# EAGLE design RetroESP32.serial (EAGLE 9.6.2)

## Sheet 1 of 9: POWER (SOURCE, BATTERY, CHARGE, CONTROL)
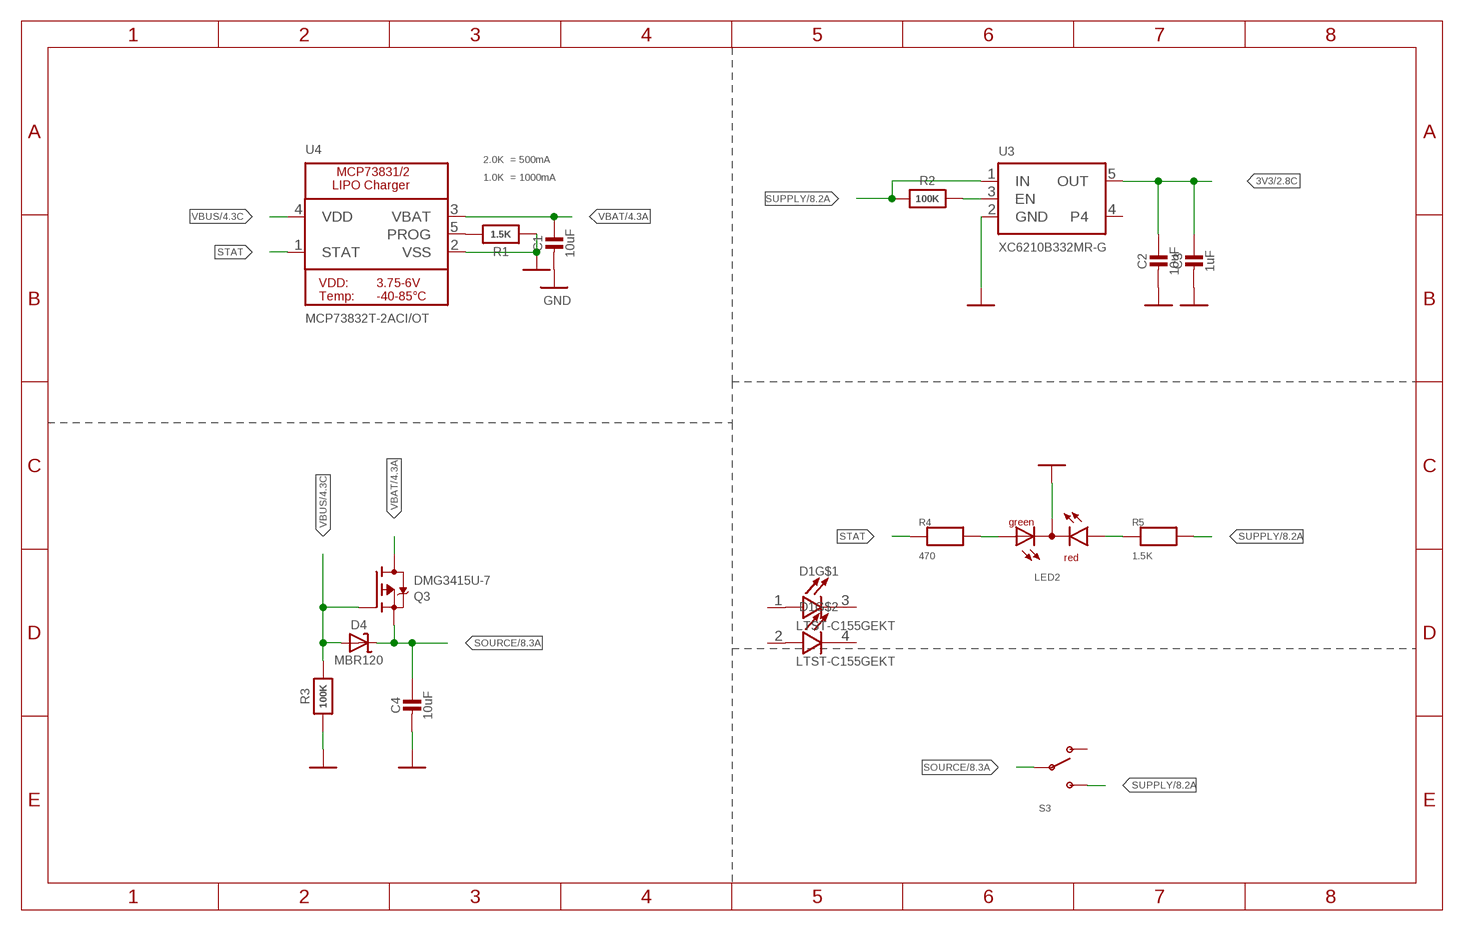
[diagram p0: schematic, sheet 1]

### Parts
C1  10uF  CAP_CERAMIC  [0603-MINI-CAP]
C2  10uF  CAP_CERAMIC  [0603-MINI-CAP]
C3  1uF  CAP_CERAMIC  [0603-MINI-CAP]
C4  10uF  CAP_CERAMIC  [0603-MINI-CAP]
D1  LTST-C155GEKT  [LED_LTST-C155GEKT]
D4  MBR120  DIODE-SCHOTTKYSOD-123  [SOD-123]
LED2  LED_L-115WEGW-CA  [LED_DUOLED-A-3MM]
Q3  DMG3415U-7  MOSFET-P  [SOT23-R]
R1  1.5K  RESISTOR0603MINI  [0603-MINI]
R2  100K  RESISTOR0603MINI  [0603-MINI]
R3  100K  RESISTOR0603MINI  [0603-MINI]
R4  470  RESISTOR0603MINI  [0603-MINI]
R5  1.5K  RESISTOR0603MINI  [0603-MINI]
S3  POWER-SWITCH  [RETIRED_KPS-1290]
U3  XC6210B332MR-G  AP2112-3.3  [SOT23-5]
U4  MCP73832T-2ACI/OT  MCP73831/2  [SOT23-5-1]

### Nets
3V3: C2.1 C3.1 U3.5(OUT) ; also sheet 2,3,4,5,6,7,8
EN: R2.2 U3.3(EN)
GND: C1.2 C2.2 C3.2 C4.2 LED2.2(A) R1.1 R3.1 U3.2(GND) U4.2(VSS) ; also sheet 2,3,4,5,6,7,8
POWER_LED: LED2.3(CR) R5.1
PROG: R1.2 U4.5(PROG)
SOURCE: C4.1 D4.C Q3.2(S) S3.P ; also sheet 8
STAT: R4.1 U4.1(STAT)
STAT_LED: LED2.1(CG) R4.2
SUPPLY: R2.1 R5.2 S3.S U3.1(IN) ; also sheet 8
VBAT: C1.1 Q3.3(D) U4.3(VBAT) ; also sheet 4,8
VBUS: D4.A Q3.1(G) R3.2 U4.4(VDD) ; also sheet 4,8
Unconnected: D1.1(SHORT_A) D1.2(LONG_A) D1.3(SHORT_C) D1.4(LONG_C) S3.O U3.4

### Notes on the sheet
- 2.0K  = 500mA
- 1.0K  = 1000mA

## Sheet 2 of 9: USB UART
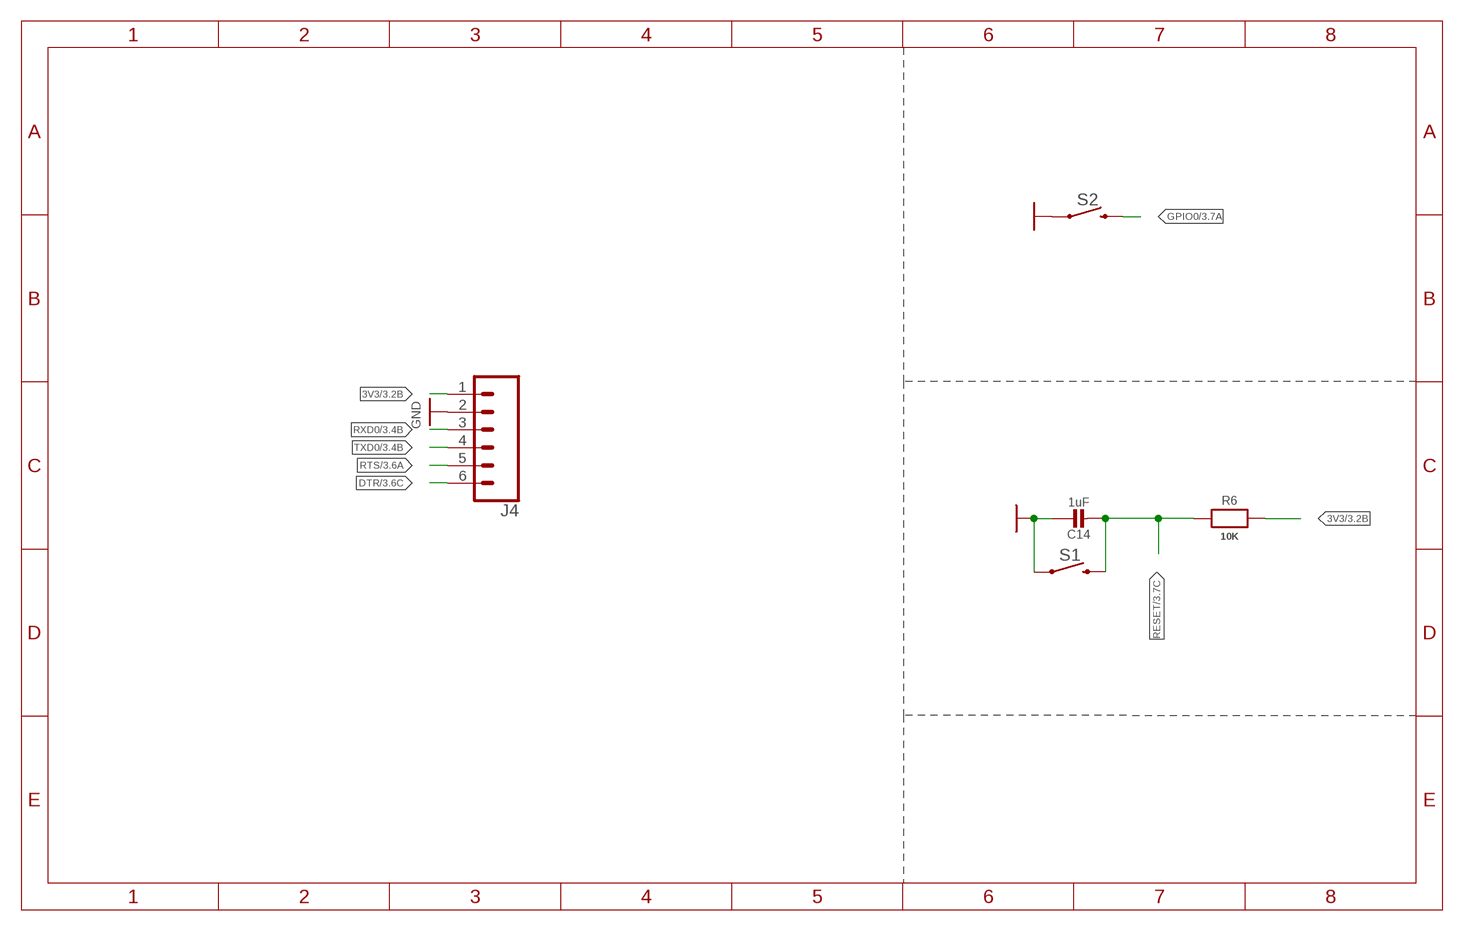
[diagram p1: schematic, sheet 2]

### Parts
C14  1uF  CAP_CERAMIC  [0603-MINI-CAP]
J4  CONN_06NO_SILK_NO_POP  [1X06_NO_SILK]
R6  10K  RESISTOR0603MINI  [0603-MINI]
S1  MOMENTARY-SWITCH-SMD-4.6X2.8MM  [SWITCHES_TACTILE_SWITCH_SMD_4.6X2.8MM]
S2  MOMENTARY-SWITCH-SMD-4.6X2.8MM  [SWITCHES_TACTILE_SWITCH_SMD_4.6X2.8MM]

### Nets
3V3: J4.1 R6.2 ; also sheet 1,3,4,5,6,7,8
DTR: J4.6 ; also sheet 3
GND: C14.1 J4.2 S1.1 S1.2 S2.1 S2.2 ; also sheet 1,3,4,5,6,7,8
GPIO0: S2.3 S2.4 ; also sheet 3,8
RESET: C14.2 R6.1 S1.3 S1.4 ; also sheet 3,6,8
RTS: J4.5 ; also sheet 3
RXD0: J4.3 ; also sheet 3
TXD0: J4.4 ; also sheet 3

## Sheet 3 of 9: ESP32 CORE
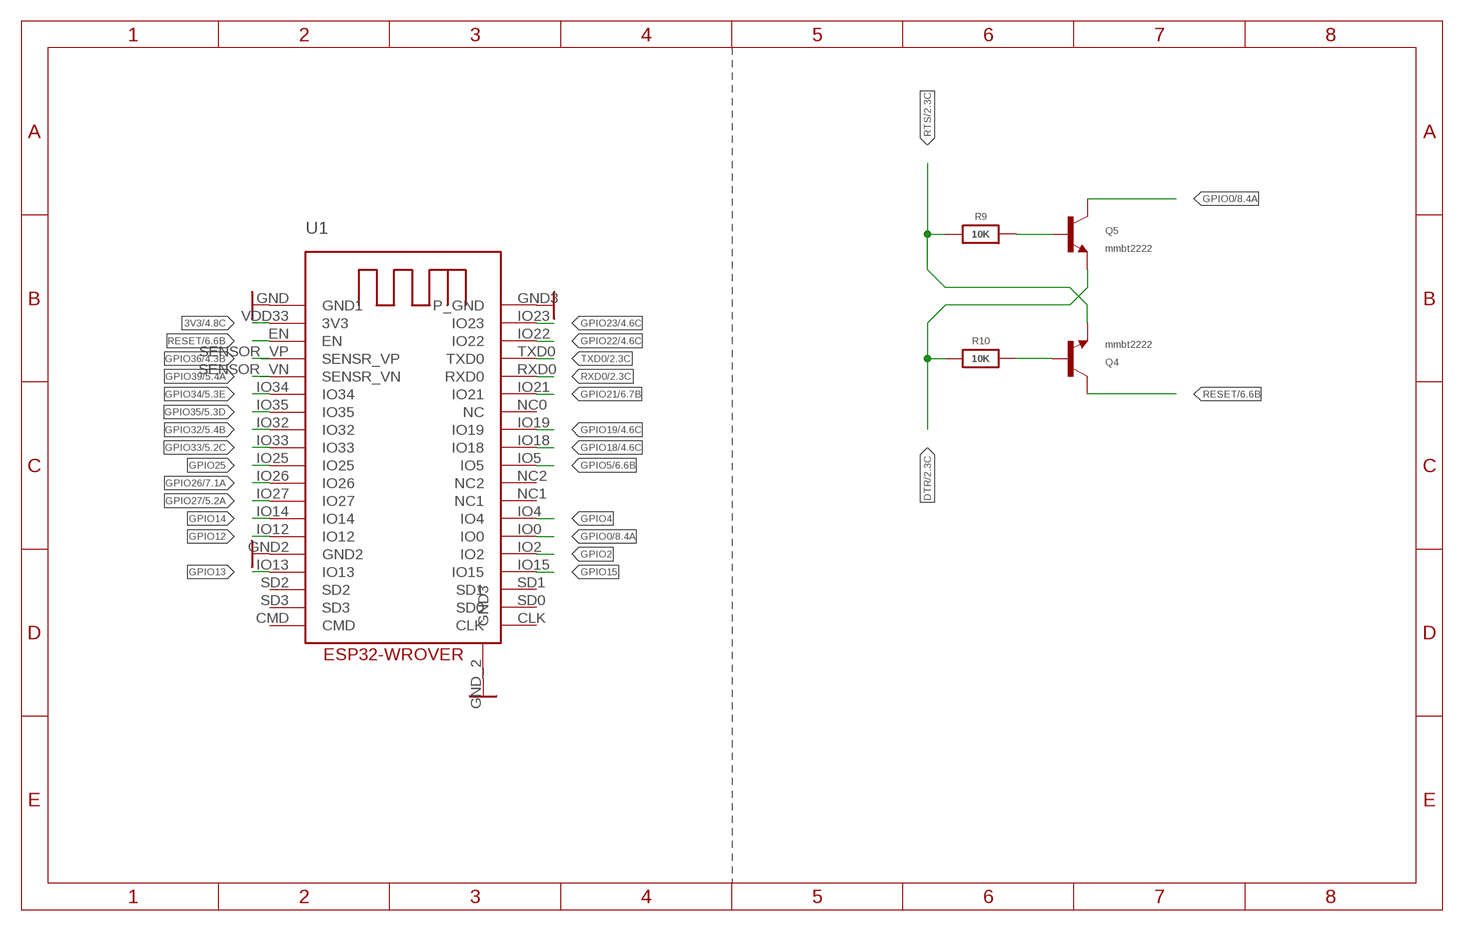
[diagram p2: schematic, sheet 3]

### Parts
Q4  mmbt2222  TRANSISTOR_NPNSOT23-3  [SOT23-3]
Q5  mmbt2222  TRANSISTOR_NPNSOT23-3  [SOT23-3]
R9  10K  RESISTOR0603MINI  [0603-MINI]
R10  10K  RESISTOR0603MINI  [0603-MINI]
U1  ESP32-WROVER  [ESP32-WROVER_ESP32-WROVER]

### Nets
3V3: U1.VDD33(3V3) ; also sheet 1,2,4,5,6,7,8
DTR: Q5.2(E) R10.1 ; also sheet 2
GND: U1.GND2 U1.GND3(P_GND) U1.GND(GND1) U1.GND_2(GND3) ; also sheet 1,2,4,5,6,7,8
GPIO0: Q5.3(C) U1.IO0 ; also sheet 2,8
GPIO2: U1.IO2
GPIO4: U1.IO4
GPIO5: U1.IO5 ; also sheet 6
GPIO12: U1.IO12
GPIO13: U1.IO13
GPIO14: U1.IO14
GPIO15: U1.IO15
GPIO18: U1.IO18 ; also sheet 4,6
GPIO19: U1.IO19 ; also sheet 4
GPIO21: U1.IO21 ; also sheet 6
GPIO22: U1.IO22 ; also sheet 4
GPIO23: U1.IO23 ; also sheet 4,6
GPIO25: U1.IO25
GPIO26: U1.IO26 ; also sheet 7
GPIO27: U1.IO27 ; also sheet 5
GPIO32: U1.IO32 ; also sheet 5
GPIO33: U1.IO33 ; also sheet 5
GPIO34: U1.IO34 ; also sheet 5
GPIO35: U1.IO35 ; also sheet 5
GPIO36: U1.SENSOR_VP(SENSR_VP) ; also sheet 4
GPIO39: U1.SENSOR_VN(SENSR_VN) ; also sheet 5
RESET: Q4.3(C) U1.EN ; also sheet 2,6,8
RST-RES: Q4.1(B) R10.2
RTS: Q4.2(E) R9.1 ; also sheet 2
RTS-RES: Q5.1(B) R9.2
RXD0: U1.RXD0 ; also sheet 2
TXD0: U1.TXD0 ; also sheet 2
Unconnected: U1.CLK U1.CMD U1.NC0(NC) U1.NC1 U1.NC2 U1.SD0 U1.SD1 U1.SD2 U1.SD3

## Sheet 4 of 9: USB + BATTERY
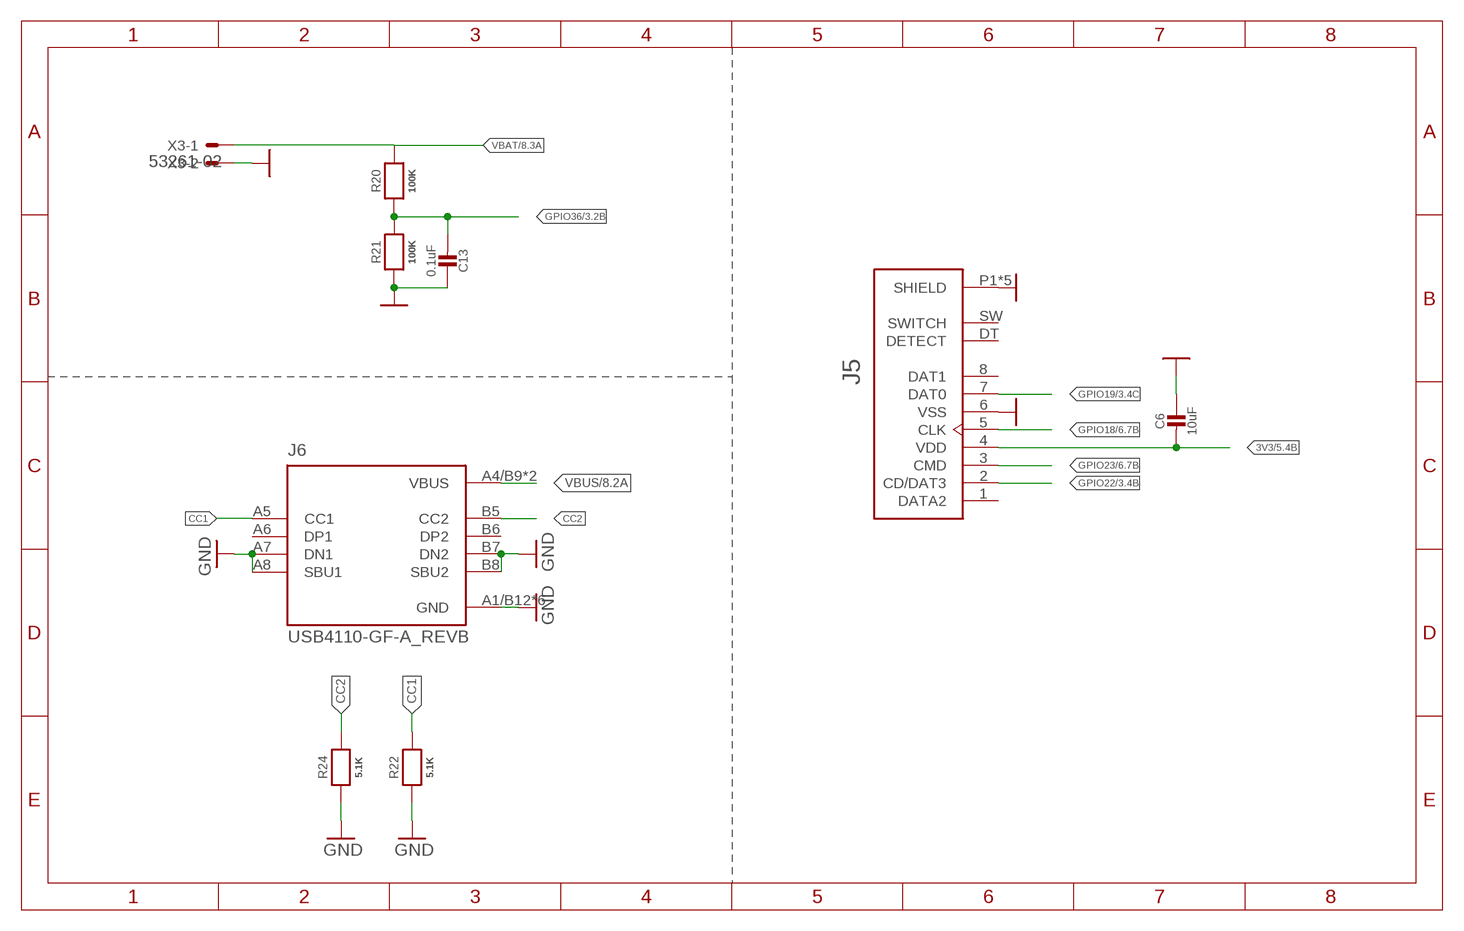
[diagram p3: schematic, sheet 4]

### Parts
C6  10uF  CAP_CERAMIC  [0603-MINI-CAP]
C13  0.1uF  CAP_CERAMIC  [0603-MINI-CAP]
J5  503182-1852_503182-1852  [503182-1852_MOLEX_503182-1852]
J6  USB4110-GF-A_REVB  [GCT_USB4110-GF-A_REVB]
R20  100K  RESISTOR0603MINI  [0603-MINI]
R21  100K  RESISTOR0603MINI  [0603-MINI]
R22  5.1K  RESISTOR0603MINI  [0603-MINI]
R24  5.1K  RESISTOR0603MINI  [0603-MINI]
X3  53261-02  [53261-02]

### Nets
3V3: C6.2 J5.4(VDD) ; also sheet 1,2,3,5,6,7,8
CC1: J6.A5(CC1) R22.2
CC2: J6.B5(CC2) R24.2
GND: C6.1 C13.1 J5.6(VSS) J5.P1(SHIELD) J5.P2(SHIELD) J5.P3(SHIELD) J5.P4(SHIELD) J5.P5(SHIELD) J6.A1/B12(GND) J6.A7(DN1) J6.A8(SBU1) J6.B1/A12(GND) J6.B7(DN2) J6.B8(SBU2) J6.S1(GND) J6.S2(GND) J6.S3(GND) J6.S4(GND) R21.1 R22.1 R24.1 X3.2 ; also sheet 1,2,3,5,6,7,8
GPIO18: J5.5(CLK) ; also sheet 3,6
GPIO19: J5.7(DAT0) ; also sheet 3
GPIO22: J5.2(CD/DAT3) ; also sheet 3
GPIO23: J5.3(CMD) ; also sheet 3,6
GPIO36: C13.2 R20.1 R21.2 ; also sheet 3
VBAT: R20.2 X3.1 ; also sheet 1,8
VBUS: J6.A4/B9(VBUS) J6.B4/A9(VBUS) ; also sheet 1,8
Unconnected: J5.1(DATA2) J5.8(DAT1) J5.DT(DETECT) J5.SW(SWITCH) J6.A6(DP1) J6.B6(DP2)

## Sheet 5 of 9: GPIO
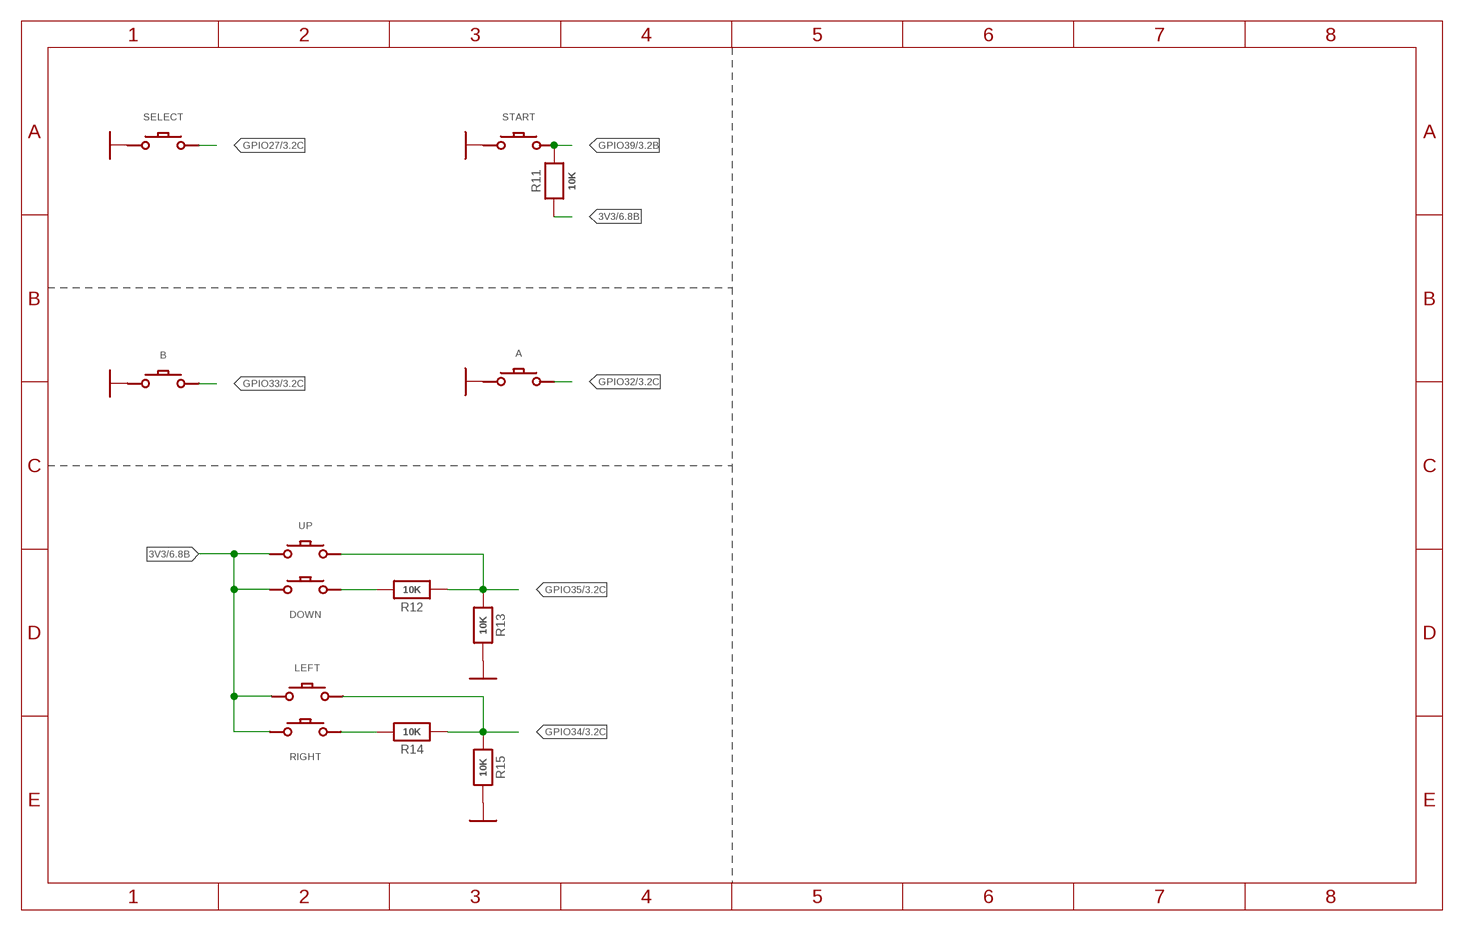
[diagram p4: schematic, sheet 5]

### Parts
A  BUTTONSCONDUCTIVE_BUTTON_MGB  [ACTION-GAMEBOY]
B  BUTTONSCONDUCTIVE_BUTTON_MGB  [ACTION-GAMEBOY]
DOWN  BUTTONSCONDUCTIVE_BUTTON_DIRECTION_THIN  [DIRECTIONAL-SPACED-PAD]
LEFT  BUTTONSCONDUCTIVE_BUTTON_DIRECTION_THIN  [DIRECTIONAL-SPACED-PAD]
R11  10K  RESISTOR0603MINI  [0603-MINI]
R12  10K  RESISTOR0603MINI  [0603-MINI]
R13  10K  RESISTOR0603MINI  [0603-MINI]
R14  10K  RESISTOR0603MINI  [0603-MINI]
R15  10K  RESISTOR0603MINI  [0603-MINI]
RIGHT  BUTTONSCONDUCTIVE_BUTTON_DIRECTION_THIN  [DIRECTIONAL-SPACED-PAD]
SELECT  BUTTON_START+SELECT  [START+SELECT-STANDARD]
START  BUTTON_START+SELECT  [START+SELECT-STANDARD]
UP  BUTTONSCONDUCTIVE_BUTTON_DIRECTION_THIN  [DIRECTIONAL-SPACED-PAD]

### Nets
3V3: DOWN.P$GND LEFT.P$GND R11.1 RIGHT.P$GND UP.P$GND ; also sheet 1,2,3,4,6,7,8
DOWN: DOWN.P$ACTIVE R12.2
GND: A.P$GND A.P$GND1(P$GND) B.P$GND B.P$GND1(P$GND) R13.2 R15.2 SELECT.P$GND SELECT.P$GND1(P$GND) SELECT.P$GND2(P$GND) SELECT.P$GND3(P$GND) START.P$GND START.P$GND1(P$GND) START.P$GND2(P$GND) START.P$GND3(P$GND) ; also sheet 1,2,3,4,6,7,8
GPIO27: SELECT.P$ACTIVE SELECT.P$ACTIVE1(P$ACTIVE) SELECT.P$ACTIVE2(P$ACTIVE) SELECT.P$ACTIVE3(P$ACTIVE) SELECT.P$ACTIVE4(P$ACTIVE) SELECT.P$ACTIVE5(P$ACTIVE) SELECT.P$ACTIVE6(P$ACTIVE) ; also sheet 3
GPIO32: A.P$ACTIVE A.P$ACTIVE1(P$ACTIVE) ; also sheet 3
GPIO33: B.P$ACTIVE B.P$ACTIVE1(P$ACTIVE) ; also sheet 3
GPIO34: LEFT.P$ACTIVE R14.1 R15.1 ; also sheet 3
GPIO35: R12.1 R13.1 UP.P$ACTIVE ; also sheet 3
GPIO39: R11.2 START.P$ACTIVE START.P$ACTIVE1(P$ACTIVE) START.P$ACTIVE2(P$ACTIVE) START.P$ACTIVE3(P$ACTIVE) START.P$ACTIVE4(P$ACTIVE) START.P$ACTIVE5(P$ACTIVE) START.P$ACTIVE6(P$ACTIVE) ; also sheet 3
RIGHT: R14.2 RIGHT.P$ACTIVE

## Sheet 6 of 9: SCREEN + BRIGHTNESS
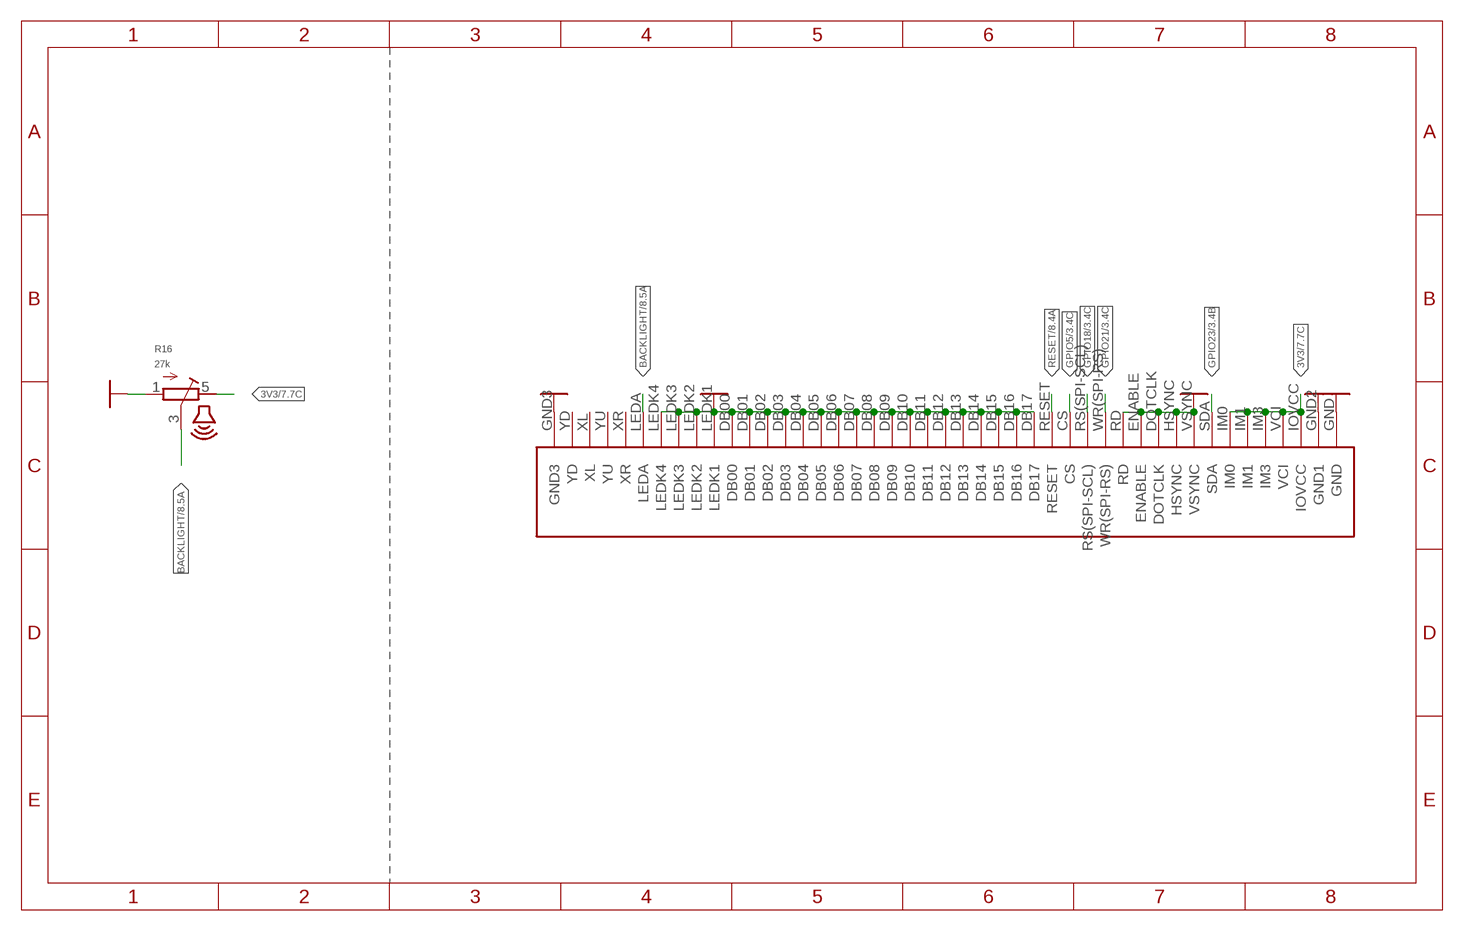
[diagram p5: schematic, sheet 6]

### Parts
R16  27k  THUMBWHEEL  [THUMBWHEEL]
U$11  LCD-ILI9342C  [KD026LQTMA008]

### Nets
3V3: R16.5(E) U$11.IM0 U$11.IM1 U$11.IM3 U$11.IOVCC U$11.VCI ; also sheet 1,2,3,4,5,7,8
BACKLIGHT: R16.3(S) U$11.LEDA ; also sheet 8
GND: R16.1(A) U$11.DB00 U$11.DB01 U$11.DB02 U$11.DB03 U$11.DB04 U$11.DB05 U$11.DB06 U$11.DB07 U$11.DB08 U$11.DB09 U$11.DB10 U$11.DB11 U$11.DB12 U$11.DB13 U$11.DB14 U$11.DB15 U$11.DB16 U$11.DB17 U$11.DOTCLK U$11.ENABLE U$11.GND U$11.GND2(GND1) U$11.GND3 U$11.HSYNC U$11.LEDK1 U$11.LEDK2 U$11.LEDK3 U$11.LEDK4 U$11.RD U$11.VSYNC ; also sheet 1,2,3,4,5,7,8
GPIO5: U$11.CS ; also sheet 3
GPIO18: U$11.RS(SPI-SCL) ; also sheet 3,4
GPIO21: U$11.WR(SPI-RS) ; also sheet 3
GPIO23: U$11.SDA ; also sheet 3,4
RESET: U$11.RESET ; also sheet 2,3,8
Unconnected: U$11.XL U$11.XR U$11.YD U$11.YU

## Sheet 7 of 9: AUDIO
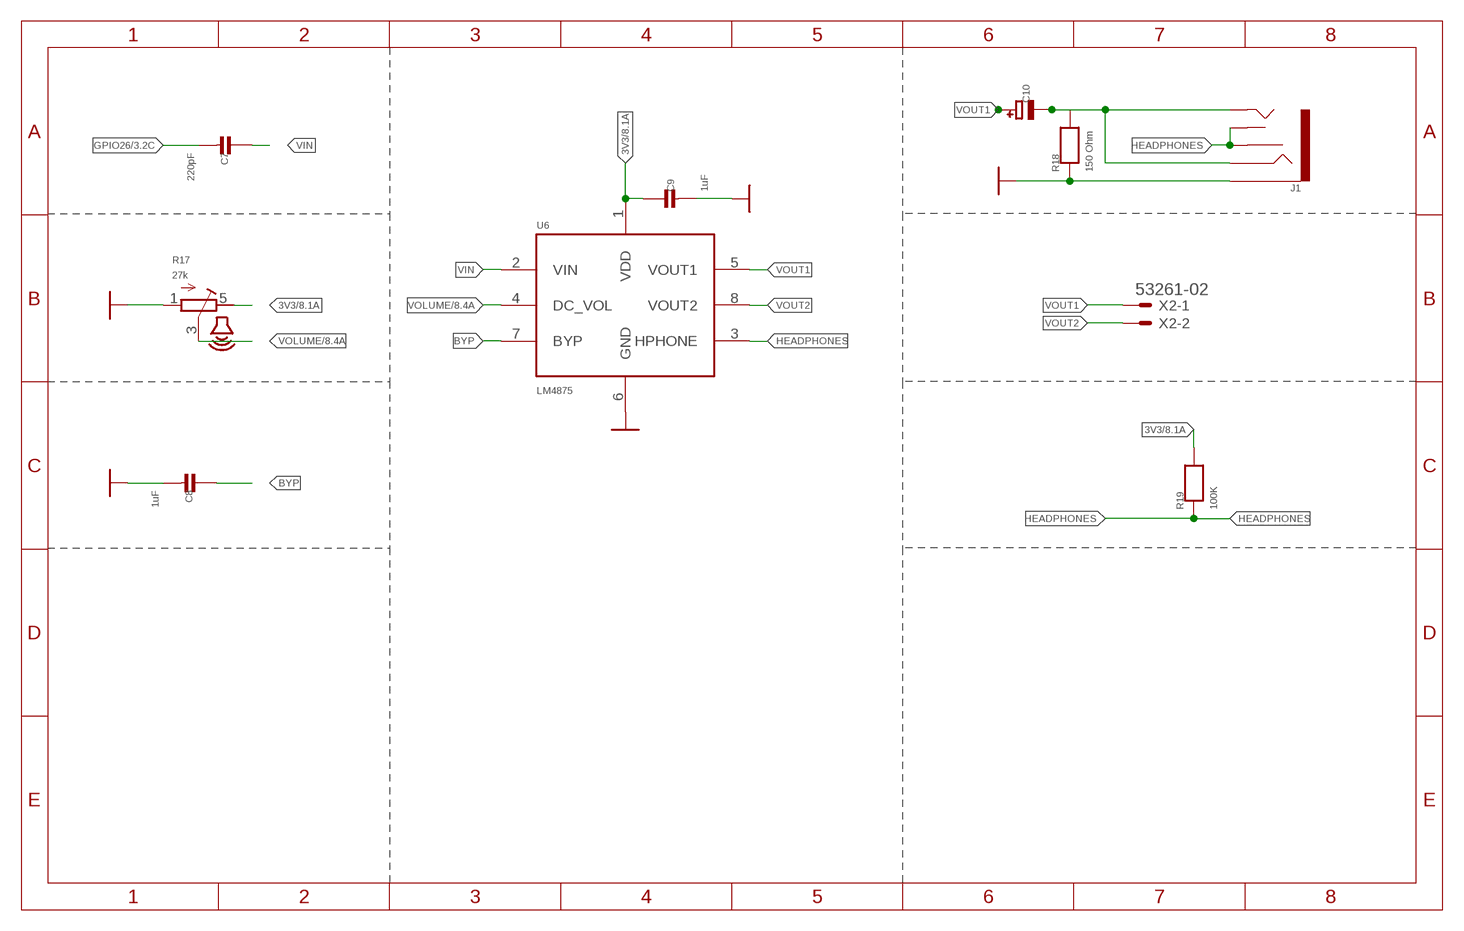
[diagram p6: schematic, sheet 7]

### Parts
C7  220pF  CAP_CERAMIC  [0603-MINI-CAP]
C8  1uF  CAP_CERAMIC  [0603-MINI-CAP]
C9  1uF  CAP_CERAMIC  [0603-MINI-CAP]
C10  100uF  CAP_TANTALUMA/3216_WAVE  [EIA3216-18/A-W]
J1  AUDIO_JACK_3.5MM_KIT  [AUDIO-JACK-KIT]
R17  27k  THUMBWHEEL  [THUMBWHEEL]
R18  150 Ohm  RESISTOR0603MINI  [0603-MINI]
R19  100K  RESISTOR0603MINI  [0603-MINI]
U6  LM4875  [SOIC8]
X2  53261-02  [53261-02]

### Nets
3V3: C9.1 R17.5(E) R19.2 U6.1(VDD) ; also sheet 1,2,3,4,5,6,8
BYP: C8.1 U6.7(BYP)
GND: C8.2 C9.2 J1.SLEEVE R17.1(A) R18.1 U6.6(GND) ; also sheet 1,2,3,4,5,6,8
GPIO26: C7.2 ; also sheet 3
HEADPHONES: J1.RSH J1.TSH R19.1 U6.3(HPHONE)
VIN: C7.1 U6.2(VIN)
VIN1: C10.- J1.RING J1.TIP R18.2
VOLUME: R17.3(S) U6.4(DC_VOL) ; also sheet 8
VOUT1: C10.+ U6.5(VOUT1) X2.1
VOUT2: U6.8(VOUT2) X2.2

## Sheet 8 of 9: TEST POINTS
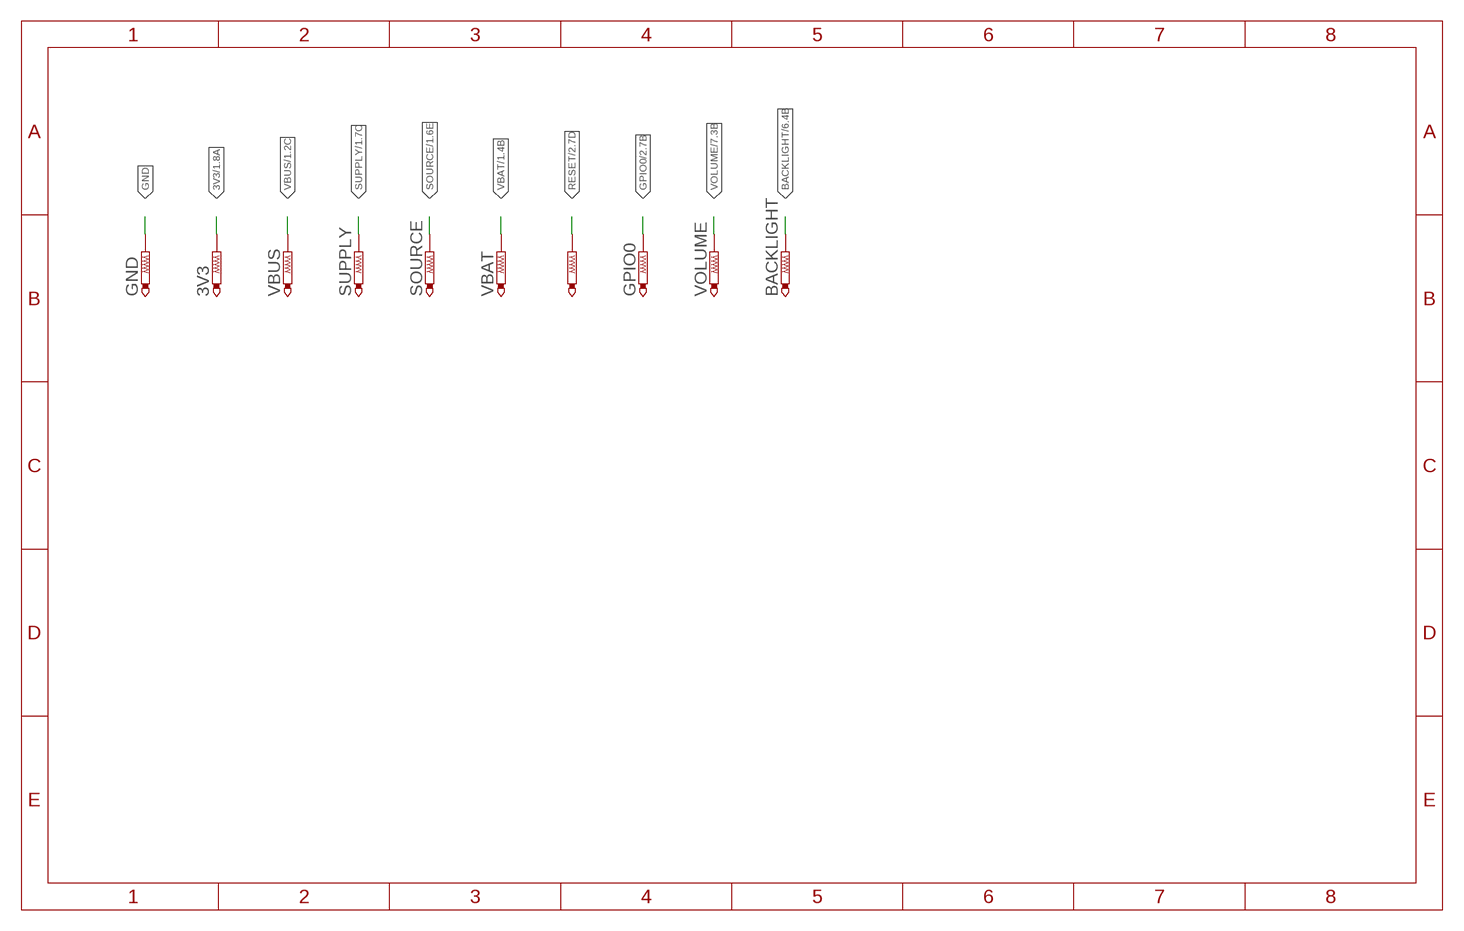
[diagram p7: schematic, sheet 8]

### Parts
3V3  TESTPADTP18R  [TESTPAD]
BACKLIGHT  TESTPADTP18R  [TESTPAD]
GND  GND  TESTPADTP18R  [TESTPAD]
GPIO0  TESTPADTP18R  [TESTPAD]
RESET  TESTPADTP18R  [TESTPAD]
SOURCE  TESTPADTP18R  [TESTPAD]
SUPPLY  TESTPADTP18R  [TESTPAD]
VBAT  TESTPADTP18R  [TESTPAD]
VBUS  TESTPADTP18R  [TESTPAD]
VOLUME  TESTPADTP18R  [TESTPAD]

### Nets
3V3: 3V3.TP ; also sheet 1,2,3,4,5,6,7
BACKLIGHT: BACKLIGHT.TP ; also sheet 6
GND: GND.TP ; also sheet 1,2,3,4,5,6,7
GPIO0: GPIO0.TP ; also sheet 2,3
RESET: RESET.TP ; also sheet 2,3,6
SOURCE: SOURCE.TP ; also sheet 1
SUPPLY: SUPPLY.TP ; also sheet 1
VBAT: VBAT.TP ; also sheet 1,4
VBUS: VBUS.TP ; also sheet 1,4
VOLUME: VOLUME.TP ; also sheet 7

## Sheet 9 of 9: Board and Logos
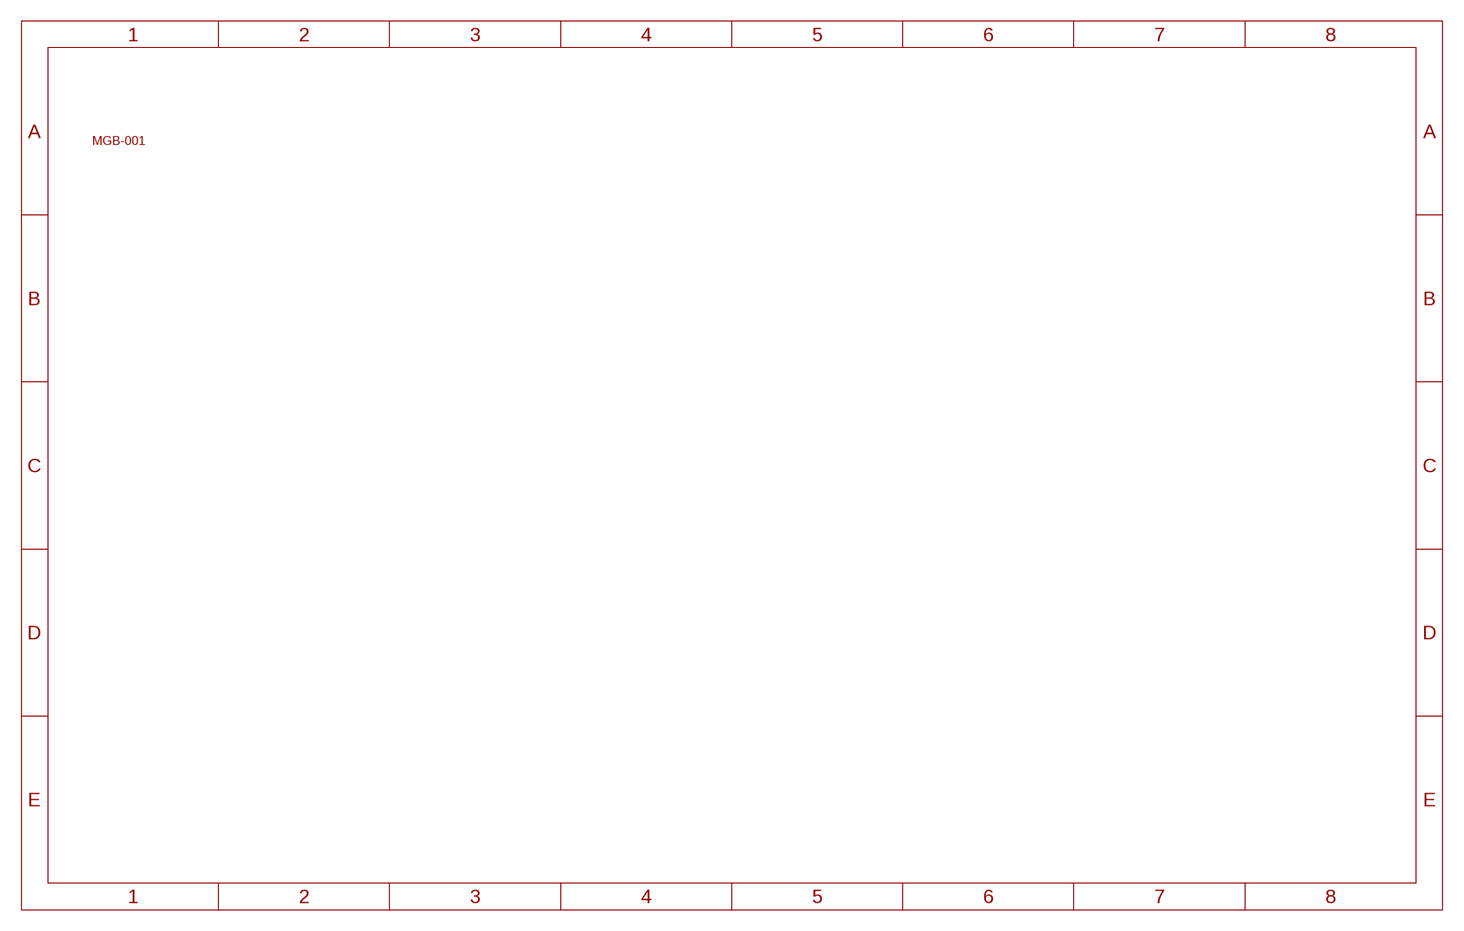
[diagram p8: schematic, sheet 9]

### Parts
U$17  POCKET-BOARDSMGB-001-ESP32-LITE  [MGB-001-ESP32-LITE]

## Library data of the parts
3V3 BACKLIGHT GND GPIO0 RESET SOURCE SUPPLY VBAT VBUS VOLUME = RetroESP32:TESTPAD: TEST PIN
A DOWN LEFT RIGHT UP = RetroESP32:BUTTONS; IGNORE_BOM: TRUE
B = RetroESP32:BUTTONS; IGNORE_BOM: TRUE; SPICEPREFIX: B
C1 C2 C4 C6 = RetroESP32:CAP_CERAMIC: Ceramic Capacitors For new designs, use the packages preceded by an '_' character since they are more reliable: The following footprints should be used on most boards: _0402 - Standard footprint for regular board layouts _0603 - Standard footprint for regular board layouts _0805 - Standard footprint for regular board layouts _1206 - Standard footprint for regular board layouts For extremely tight-pitch boards where space is at a premium, the following 'micro-pitch' footprints can be used (smaller pads, no silkscreen outline, etc.): _0402MP - Micro-pitch footprint for very dense/compact boards _0603MP - Micro-pitch footprint for very dense/compact boards _0805MP - Micro-pitch footprint for very dense/compact boards _1206MP - Micro-pitch footprint for very dense/compact boards; MPN: CL10A106MP8NNNC
C3 C8 C9 C14 = RetroESP32:CAP_CERAMIC: Ceramic Capacitors For new designs, use the packages preceded by an '_' character since they are more reliable: The following footprints should be used on most boards: _0402 - Standard footprint for regular board layouts _0603 - Standard footprint for regular board layouts _0805 - Standard footprint for regular board layouts _1206 - Standard footprint for regular board layouts For extremely tight-pitch boards where space is at a premium, the following 'micro-pitch' footprints can be used (smaller pads, no silkscreen outline, etc.): _0402MP - Micro-pitch footprint for very dense/compact boards _0603MP - Micro-pitch footprint for very dense/compact boards _0805MP - Micro-pitch footprint for very dense/compact boards _1206MP - Micro-pitch footprint for very dense/compact boards; MPN: CL10A105KP8NNNC
C7 = RetroESP32:CAP_CERAMIC: Ceramic Capacitors For new designs, use the packages preceded by an '_' character since they are more reliable: The following footprints should be used on most boards: _0402 - Standard footprint for regular board layouts _0603 - Standard footprint for regular board layouts _0805 - Standard footprint for regular board layouts _1206 - Standard footprint for regular board layouts For extremely tight-pitch boards where space is at a premium, the following 'micro-pitch' footprints can be used (smaller pads, no silkscreen outline, etc.): _0402MP - Micro-pitch footprint for very dense/compact boards _0603MP - Micro-pitch footprint for very dense/compact boards _0805MP - Micro-pitch footprint for very dense/compact boards _1206MP - Micro-pitch footprint for very dense/compact boards; MPN: CL10C221JB8NNNC
C10 = RetroESP32:CAP_TANTALUM: Tantalum Capacitors Wave footprints have larger pads and are meant to be used for hand soldering. Reflow footprints are optimised for solder paste and a reflow oven. EIA3216-18/A-[R/W] - Size A / 3216-18 / 1206 footprint 4.7µF 25V 10% Tantalum Capacitor 10µF 16V 10% Tantalum Capacitor [Digikey: 495-2236-2-ND] EIA3528-21/B-[R/W] - Size B / 3528-21 47µF 10V 10% Tantalum Capactior [Digikey: 495-2216-1-ND] EIA6032-28/C-[R/W] - Size C / 6032-28 10µF 35V 20% Tantalum Capacitor [Digikey: 495-2285-1-ND] 100µF 16V 10% Tantalum Capactior [Digikey: 399-5214-1-ND]; MPN: F930J107KAA
C13 = RetroESP32:CAP_CERAMIC: Ceramic Capacitors For new designs, use the packages preceded by an '_' character since they are more reliable: The following footprints should be used on most boards: _0402 - Standard footprint for regular board layouts _0603 - Standard footprint for regular board layouts _0805 - Standard footprint for regular board layouts _1206 - Standard footprint for regular board layouts For extremely tight-pitch boards where space is at a premium, the following 'micro-pitch' footprints can be used (smaller pads, no silkscreen outline, etc.): _0402MP - Micro-pitch footprint for very dense/compact boards _0603MP - Micro-pitch footprint for very dense/compact boards _0805MP - Micro-pitch footprint for very dense/compact boards _1206MP - Micro-pitch footprint for very dense/compact boards; MPN: CL10B104KB8NNNC
D1 = LTST-C155GEKT:LTST-C155GEKT; DESCRIPTION: Green, Red 569nm Green, 621nm Red LED Indication - Discrete 2.1V Green, 2V Red 1210 (3225 Metric); DIGI-KEY_PART_NUMBER: 160-1172-2-ND; MF: Lite-On Inc.; MP: LTST-C155GEKT; PACKAGE: None; PURCHASE-URL: https://pricing.snapeda.com/search?q=LTST-C155GEKT&ref=eda
D4 = RetroESP32:DIODE-SCHOTTKY; MPN: MBR120LSFT1G
J1 = RetroESP32:AUDIO_JACK_3.5MM: Audio Jack 3.5mm variants of PTH and SMT stereo audio jack with bypass switches. SparkFun Products: SparkFun SparkPunk Sound Kit <[https://www.sparkfun.com/products/11177]> - PTH MP3 Trigger <https://www.sparkfun.com/products/13720> -3.5mm SMD SparkFun PicoBoard <https://www.sparkfun.com/products/11888>- 2.5mm SMD; MPN: SJ1-3525NG-GR; PROD_ID: CONN-10353; SF_ID: PRT-08032
J4 = SparkFun-Connectors:CONN_06: Multi connection point. Often used as Generic Header-pin footprint for 0.1 inch spaced/style header connections On any of the 0.1 inch spaced packages, you can populate with these: Break Away Headers - Straight <https://www.sparkfun.com/products/116> (PRT-00116) Break Away Male Headers - Right Angle <https://www.sparkfun.com/products/553> (PRT-00553) Female Headers <https://www.sparkfun.com/products/115> (PRT-00115) Break Away Headers - Machine Pin <https://www.sparkfun.com/products/117> (PRT-00117) Break Away Female Headers - Swiss Machine Pin <https://www.sparkfun.com/products/743> (PRT-00743) Arduino Stackable Header - 6 Pin <https://www.sparkfun.com/products/9280> (PRT-09280) For SCREWTERMINALS and SPRING TERMINALS visit here: Screw Terimnals on SparkFun.com <https://www.sparkfun.com/search/results?term=Screw+Terminals> (5mm/3.5mm/2.54mm spacing) This device is also useful as a general connection point to wire up your design to another part of your project. Our various solder wires solder well into these plated through hole pads. Hook-Up Wire - Assortment (Stranded, 22 AWG) <https://www.sparkfun.com/products/11375> (PRT-11375) Hook-Up Wire - Assortment (Solid Core, 22 AWG) <https://www.sparkfun.com/products/11367> (PRT-11367) View the entire wire category on our website here <https://www.sparkfun.com/categories/141>
J5 = RetroESP32:503182-1852_503182-1852: Conn Micro SD Card M 8 POS 1.09mm Solder RA SMD Embossed T/R 0.5A/Contact; DESCRIPTION: MICRO SD NORMAL ULTRALOWPRO8CKTE; DIGI-KEY_PART_NUMBER: WM12834CT-ND; DIGI-KEY_PURCHASE_URL: https://www.digikey.ca/product-detail/en/molex/5031821852/WM12834CT-ND/5823232?utm_source=snapeda&utm_medium=aggregator&utm_campaign=symbol; MF: Molex; MP: 5031821852; MPN: 5031821852; PACKAGE: None
J6 = USB4110-GF-A:USB4110-GF-A_REVB: Check availability <https://pricing.snapeda.com/parts/USB4110-GF-A/GCT/view-part?ref=eda>; AVAILABILITY: In Stock; DESCRIPTION: USB-C (USB TYPE-C) USB 2.0 Receptacle Connector 24 (16+8 Dummy) Position Surface Mount, Right Angle; Through Hole; MF: GCT; MP: USB4110-GF-A; MPN: USB4105-GF-A; PACKAGE: None; PRICE: None; PURCHASE-URL: https://pricing.snapeda.com/search/part/USB4110-GF-A/?ref=eda
LED2 = RetroESP32:LED_L-115WEGW-CA: T-1(3mm) BI-COLOR INDICATOR LAMP Source: Kingbright .. 2_colour_led_.pdf; MPN: SSL-LX3059IGW
Q3 = RetroESP32:MOSFET-P: P-Channel Mosfet LEGEND VDS: Voltage Drain-Source ID: Drain Current RDS(ON): Drain-Source On-State Resistance VGS(TH): Gate-Source Threshold Voltage CISS: Drain-Source Input Capacitance SOT-23 Name VDS ID RDS(ON) VGS(TH) CISS Order Number IRLML5103 30V 760mA 600 mOhm -- 75pF @ 25V Digikey: IRLML5103PBFCT-ND IRLML6401 12V 4.3A 50 mOhm 950mV @ 250µA 830pF @ 10V Digikey: IRLML6401PBFTR-ND NTR0202PL 20V 400mA 800 mOhm 2.3V @ 250uA 70pF @ 5V Digikey: NTR0202PLT1GOSTR-ND NTR4101PT1G 20V 1.8A 85 mOhm 1.2V @ 250uA 675pF @ 10V Digikey: NTR4101PT1GOSCT-ND DMP2004K 20V 600mA 900 mOhm 1V @ 250uA 175pF @ 16V Digikey: DMP2004KDICT-ND PMV65XP 20V 3.9A 76 mOhm 950mV @ 1mA 725pF @ 20V Digikey: 568-2358-2-ND TO-252 Name VDS ID RDS(ON) VGS(TH) CISS Order Number AOD417 30V 25A 34 mOhm 3V @ 250µA 920pF @ 15V Digikey: 785-1106-2-ND; MPN: DMG3415U-7
Q4 Q5 = RetroESP32:TRANSISTOR_NPN: Transistor NPN BJT configuration in SOT23 package. MMBT2222 is the common NPN we use. Double check BCE configuration again layout.; MPN: MMBT2222A-7-F
R1 R5 = RetroESP32:RESISTOR: Resistors For new designs, use the packages preceded by an '_' character since they are more reliable: The following footprints should be used on most boards: _0402 - Standard footprint for regular board layouts _0603 - Standard footprint for regular board layouts _0805 - Standard footprint for regular board layouts _1206 - Standard footprint for regular board layouts For extremely tight-pitch boards where space is at a premium, the following 'micro-pitch' footprints can be used (smaller pads, no silkscreen outline, etc.): _0402MP - Micro-pitch footprint for very dense/compact boards _0603MP - Micro-pitch footprint for very dense/compact boards _0805MP - Micro-pitch footprint for very dense/compact boards _1206MP - Micro-pitch footprint for very dense/compact boards; MPN: ERJ-PA3J152V
R2 R3 R19-R21 = RetroESP32:RESISTOR: Resistors For new designs, use the packages preceded by an '_' character since they are more reliable: The following footprints should be used on most boards: _0402 - Standard footprint for regular board layouts _0603 - Standard footprint for regular board layouts _0805 - Standard footprint for regular board layouts _1206 - Standard footprint for regular board layouts For extremely tight-pitch boards where space is at a premium, the following 'micro-pitch' footprints can be used (smaller pads, no silkscreen outline, etc.): _0402MP - Micro-pitch footprint for very dense/compact boards _0603MP - Micro-pitch footprint for very dense/compact boards _0805MP - Micro-pitch footprint for very dense/compact boards _1206MP - Micro-pitch footprint for very dense/compact boards; MPN: ERJ-PA3J104V
R4 = RetroESP32:RESISTOR: Resistors For new designs, use the packages preceded by an '_' character since they are more reliable: The following footprints should be used on most boards: _0402 - Standard footprint for regular board layouts _0603 - Standard footprint for regular board layouts _0805 - Standard footprint for regular board layouts _1206 - Standard footprint for regular board layouts For extremely tight-pitch boards where space is at a premium, the following 'micro-pitch' footprints can be used (smaller pads, no silkscreen outline, etc.): _0402MP - Micro-pitch footprint for very dense/compact boards _0603MP - Micro-pitch footprint for very dense/compact boards _0805MP - Micro-pitch footprint for very dense/compact boards _1206MP - Micro-pitch footprint for very dense/compact boards; MPN: ERJ-PA3J471V
R6 R9-R15 = RetroESP32:RESISTOR: Resistors For new designs, use the packages preceded by an '_' character since they are more reliable: The following footprints should be used on most boards: _0402 - Standard footprint for regular board layouts _0603 - Standard footprint for regular board layouts _0805 - Standard footprint for regular board layouts _1206 - Standard footprint for regular board layouts For extremely tight-pitch boards where space is at a premium, the following 'micro-pitch' footprints can be used (smaller pads, no silkscreen outline, etc.): _0402MP - Micro-pitch footprint for very dense/compact boards _0603MP - Micro-pitch footprint for very dense/compact boards _0805MP - Micro-pitch footprint for very dense/compact boards _1206MP - Micro-pitch footprint for very dense/compact boards; MPN: ERJ-PA3J103V
R16 R17 = RetroESP32:THUMBWHEEL
R18 = RetroESP32:RESISTOR: Resistors For new designs, use the packages preceded by an '_' character since they are more reliable: The following footprints should be used on most boards: _0402 - Standard footprint for regular board layouts _0603 - Standard footprint for regular board layouts _0805 - Standard footprint for regular board layouts _1206 - Standard footprint for regular board layouts For extremely tight-pitch boards where space is at a premium, the following 'micro-pitch' footprints can be used (smaller pads, no silkscreen outline, etc.): _0402MP - Micro-pitch footprint for very dense/compact boards _0603MP - Micro-pitch footprint for very dense/compact boards _0805MP - Micro-pitch footprint for very dense/compact boards _1206MP - Micro-pitch footprint for very dense/compact boards; MPN: ERJ-PA3J151V
R22 R24 = RetroESP32:RESISTOR: Resistors For new designs, use the packages preceded by an '_' character since they are more reliable: The following footprints should be used on most boards: _0402 - Standard footprint for regular board layouts _0603 - Standard footprint for regular board layouts _0805 - Standard footprint for regular board layouts _1206 - Standard footprint for regular board layouts For extremely tight-pitch boards where space is at a premium, the following 'micro-pitch' footprints can be used (smaller pads, no silkscreen outline, etc.): _0402MP - Micro-pitch footprint for very dense/compact boards _0603MP - Micro-pitch footprint for very dense/compact boards _0805MP - Micro-pitch footprint for very dense/compact boards _1206MP - Micro-pitch footprint for very dense/compact boards; MPN: ERJ-PA3F5101V
S1 S2 = RetroESP32:MOMENTARY-SWITCH: Momentary Switch (Pushbutton) - SPST Normally-open (NO) SPST momentary switches (buttons, pushbuttons). Variants PTH-12MM - 12mm square, through-hole Momentary Pushbutton Switch - 12mm Square <https://www.sparkfun.com/products/9190> (COM-09190) PTH-6.0MM, PTH-6.0MM-KIT - 6.0mm square, through-hole Mini Pushbutton Switch <https://www.sparkfun.com/products/97> (COM-00097) KIT package intended for soldering kit's - only one side of pads' copper is exposed. PTH-RIGHT-ANGLE-KIT - Right-angle, through-hole Right Angle Tactile Button <https://www.sparkfun.com/products/10791> - Used on SparkFun BigTime Watch Kit <https://www.sparkfun.com/products/11734> SMD-12MM - 12mm square, surface-mount Tactile Button - SMD (12mm) <https://www.sparkfun.com/products/12993> (COM-12993) Used on SparkFun PicoBoard <https://www.sparkfun.com/products/11888> SMD-4.5MM - 4.5mm Square Trackball Switch Used on SparkFun Blackberry Trackballer Breakout <https://www.sparkfun.com/products/13169> SMD-4.6MMX2.8MM - 4.60mm x 2.80mm, surface mount Used on SparkFun SAMD21 Mini Breakout <https://www.sparkfun.com/products/13664> SMD-5.2MM, SMD-5.2-REDUNDANT - 5.2mm square, surface-mount Mini Pushbutton Switch - SMD <https://www.sparkfun.com/products/8720> (COM-08720) Used on Arduino Pro Mini <https://www.sparkfun.com/products/11114> REDUNDANT package connects both switch circuits together SMD-6.0X3.5MM - 6.0 x 3.5mm, surface mount Momentary Reset Switch SMD <https://www.sparkfun.com/products/8229> (COM-08229) SMD-6.2MM-TALL - 6.2mm square, surface mount Tactile Button - SMD (6mm) <https://www.sparkfun.com/products/12992> Used on SparkFun Digital Sandbox <https://www.sparkfun.com/products/12651> SMD-RIGHT-ANGLE - Right-angle, surface mount Used on SparkFun Block for Intel® Edison - Arduino <https://www.sparkfun.com/products/13036>; MPN: KMR221GLFS; PROD_ID: COMP-12265; SF_SKU: COM-12993
S3 = RetroESP32:POWER-SWITCH: SWCH-10651 Side-actuated SPDT slide switch, as used on the Arduino Pro; MPN: MA12RTR; PROD_ID: SWITCH SLIDE SPDT 300MA 4V
SELECT START = RetroESP32:BUTTON_START+SELECT; IGNORE_BOM: TRUE
U1 = RetroESP32:ESP32-WROVER; MPN: ESP32-WROVER (16MB)
U3 = RetroESP32:AP2112-3.3: SOT23-5 Fixed Voltage Regulators To better organise some of the SOT23-5 fixed voltage regulators in this library, this new part was created. Part Current Out V Out V In V Dropout Digikey Part No. ADP121 150mA 3.3V 3.4-5.5V 0.09V @ 150mA ADP121-AUJZ33R7CT-ND ADP121 150mA 3.0V 3.1-5.5V 0.09V @ 150mA ADP121-AUJZ30R7CT-ND ADP122 300mA 3.3V 3.4-5.5V 0.085V @ 300mA ADP122AUJZ-3.3-R7CT-ND ADP1712 300mA 3.3V 3.5-5.5V 0.17V @ 300mA ADP1712AUJZ-3.3-R7TR-ND AP7311 (Low Cost) 150mA 3.3V 3.5-6V 0.15V @ 150mA AP7311-33WG-7DICT-ND LD39015M18R 150mA 1.8V 1.9V-5.5V 0.08V @ 100mA 497-6977-1-ND MCP1824T-3302E/OT 300mA 3.3V 3.5V-6V 0.2V @ 300mA MCP1824T-3302E/OTCT-ND MIC5205-2.5YM5 TR 150mA 2.5V 2.7-16V 0.165V @ 150mA 576-1257-2-ND MIC5205-3.0YM5 TR 150mA 3.0V 3.2V-16V 0.165V @ 150mA 576-1258-2-ND MIC5205-3.3YM5 TR 150mA 3.3V 3.5V-16V 0.165V @ 150mA 576-1259-2-ND TPS780330220 150mA 3.3V+2.2V 3.6-5.5V 250mV Max 296-23332-1-ND TDA3663/N1,135 100mA 3.3V 3.5-45V 0.18V @ 50mA 568-5343-1-ND; MPN: XC6210B332MR-G
U4 = RetroESP32:MCP73831/2: MCP73831/2 LIPO Charger VDD: 3.75 - 6V Temp -40 - 85°C Programmable Charge Rate: 15-500mA NOTE: STAT is a tri-state logic output on the MCP73831 and an open-drain output on the MCP73832. SOT23-5 with 4.2V output and tri-state logic on STAT = MCP73831T-2ACI/OT; MPN: MCP73832T-2ACI/OT
U6 = RetroESP32:LM4875; MPN: LM4875MX/NOPB
U$11 = RetroESP32:LCD-ILI9342C; MPN: 0541324562
U$17 = RetroESP32:POCKET-BOARDS: MGB-001 Game Boy Pocket This is the footprint and dimensions outline for the Game Boy Pocket PCB Variants MGB-001 - Standard Game Boy Pocket MGB-001-ESP32 - Game Boy Pocket w/ Antenna Cut Out
X2 X3 = con-molex:53?-02: CONNECTOR wire to board 1.25 mm (.049 inch) pitch header; MF: MOLEX; MPN: 0532614002; OC_FARNELL: 1125373; OC_NEWARK: unknown

## Board
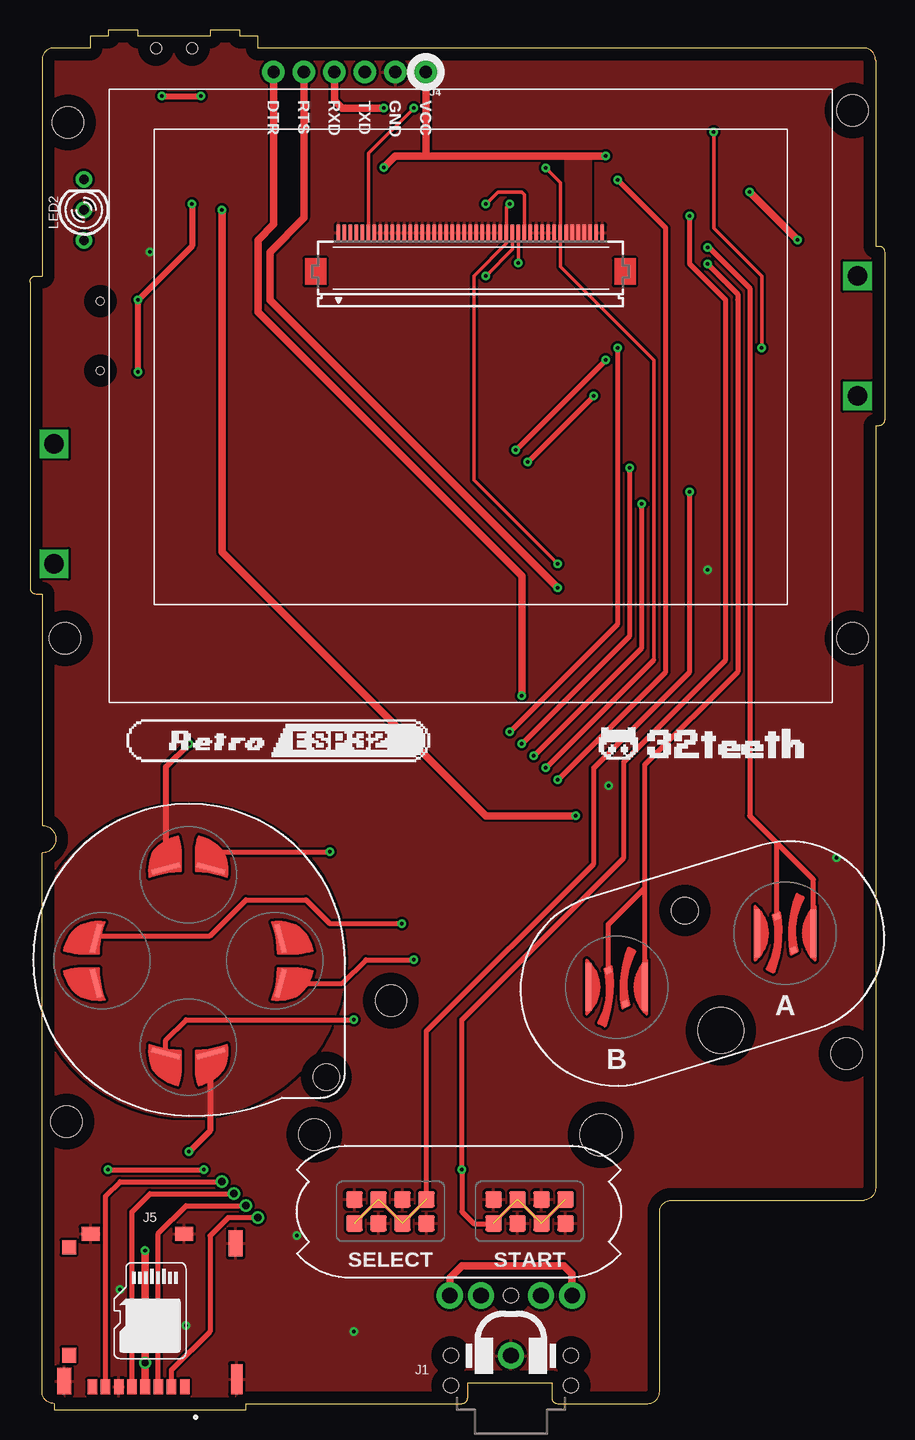
[diagram p9: board, top side]
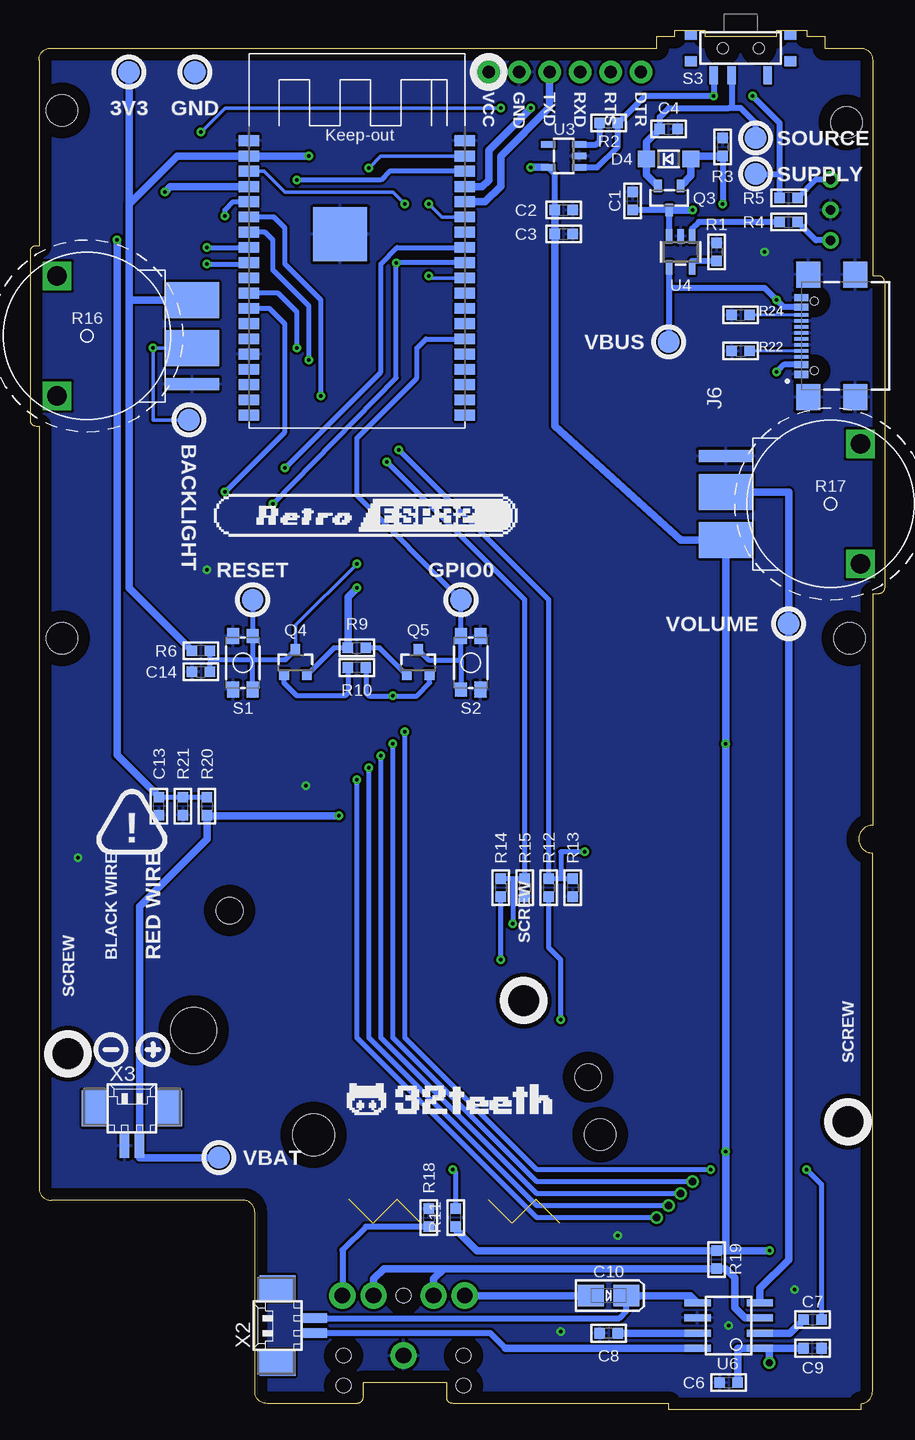
[diagram p10: board, bottom side, seen from below]

Size 71.25 x 115 mm. Coordinates in mm from the lower left corner, seen from the top.
Copper layers (1*16): Top 0.035mm / dielectric 1mm / Bottom 0.035mm
Design rules "default *": minimum track width 10mil, minimum drill 24mil, track to track 8mil, track to pad 8mil, pad to pad 8mil, via to via 8mil, smd to smd 8mil, copper to edge 40mil, drill to drill 8mil, minimum pad ring 10mil, minimum via ring 8mil, stop-mask expansion 5mil, vias tented up to drill 10mil, thermal gap 10mil

### Footprints (pad centres in the part's own frame; a part is rotated, then mirrored left to right if it is on the bottom)
TESTPAD = smd 1.8 x 1.8: TP 0,0
ACTION-GAMEBOY = smd 0.5 x 4: P$ACTIVE -2.35,0; P$GND 2.35,0 | smd 0.5 x 0.5 rotated 290: P$ACTIVE1 0.7,-1.4 | smd 0.5 x 0.5 rotated 110: P$GND1 -0.7,1.4
0603-MINI-CAP = smd 0.9 x 0.9: 1 -0.75,0; 2 0.75,0
EIA3216-18/A-W = smd 2.15 x 1.8: + 1.475,0; - -1.475,0
SOD-123 = smd 1.4 x 1.4: A 1.85,0; C -1.85,0
DIRECTIONAL-SPACED-PAD = smd 2.4 x 0.4 rotated 75: P$ACTIVE -0.5,1.873 | smd 2.4 x 0.4 rotated 285: P$GND -0.5,-1.873
AUDIO-JACK-KIT = drill 1.3 pad 2.184: RING 5,5.1; RSH 5,2.5; SLEEVE 0,0; TIP 5,-5.1; TSH 5,-2.5 | hole 1.2: 0,5; -2.5,5; -2.5,-5; 0,-5; 5,0
1X06_NO_SILK = drill 1.016 pad 1.88: 1 0,0; 2 2.54,0; 3 5.08,0; 4 7.62,0; 5 10.16,0; 6 12.7,0
503182-1852_MOLEX_503182-1852 = smd 0.8 x 1.24: 1 -2.9,6.355; 2 -1.8,6.355; 3 -0.7,6.355; 4 0.4,6.355; 5 1.5,6.355; 6 2.6,6.355; 7 3.7,6.355; 8 4.8,6.355 | smd 1.16 x 1.2: DT 6.74,-5.275 | smd 0.95 x 2.5: P1 -7.245,5.725 | smd 1.15 x 2.2: P2 7.145,5.875; P3 -7.145,-5.605 | smd 1.5 x 1.15: P4 -2.84,-6.4; P5 4.94,-6.4 | smd 1.16 x 1.25: SW 6.74,3.725
GCT_USB4110-GF-A_REVB = smd 0.6 x 1.15: A1/B12 -3.2,1.075; A4/B9 -2.4,1.075; B1/A12 3.2,1.075; B4/A9 2.4,1.075 | smd 0.3 x 1.15: A5 -1.25,1.075; A6 -0.25,1.075; A7 0.25,1.075; A8 1.25,1.075; B5 1.75,1.075; B6 0.75,1.075; B7 -0.75,1.075; B8 -1.75,1.075 | smd 2.18 x 2: S1 -5.11,0.5; S2 5.11,0.5; S3 -5.11,-3.43; S4 5.11,-3.43 | hole 0.65: -2.89,0; 2.89,0
LED_DUOLED-A-3MM = drill 0.8 pad 1.4: 1 -2.54,0; 2 0,0; 3 2.54,0
SOT23-R = smd 0.635 x 1.016: 1 -0.95,-1; 2 0.95,-1; 3 0,1
SOT23-3 = smd 0.8 x 0.9: 1 -0.95,-1; 2 0.95,-1; 3 0,1.1
0603-MINI = smd 0.9 x 0.9: 1 -0.75,0; 2 0.75,0
THUMBWHEEL = smd 1 x 4.5: 1 -4,-2.25 | smd 3 x 4.5: 3 -1,-2.25; 5 3,-2.25 | drill 1.6 square: P$6 -5,9; P$7 5,9
SWITCHES_TACTILE_SWITCH_SMD_4.6X2.8MM = smd 1.3 x 1: 1 -2.23,-0.8; 2 2.23,-0.8; 3 2.23,0.8 | smd 1.2 x 1: 4 -2.23,0.8
RETIRED_KPS-1290 = smd 0.7 x 1.5: O -2.25,2.25; P 0.75,2.25; S 2.25,2.25 | smd 1 x 0.8: P$1 -4.15,1.1; P$2 -4.15,-1.1; P$3 4.15,-1.1; P$4 4.15,1.1 | hole 0.9: -1.5,0; 1.5,0
START+SELECT-STANDARD = smd 1.4 x 1.4: P$ACTIVE 3,1; P$ACTIVE1 -1,1; P$ACTIVE2 -3,-1; P$ACTIVE3 1,-1; P$GND 1,1; P$GND1 -3,1; P$GND2 -1,-1; P$GND3 3,-1 | smd 2.54 x 0.285 rotated 45: P$ACTIVE4 -2,0 | smd 2.54 x 0.285 rotated 135: P$ACTIVE5 0,0 | smd 2.54 x 0.285 rotated 225: P$ACTIVE6 2,0
ESP32-WROVER_ESP32-WROVER = smd 1.7 x 0.9: CLK 18,1.27; CMD 0,1.27; EN 0,21.59; GND 0,24.13; GND3 18,24.13; GND_2 0,6.35; IO0 18,7.62; IO2 18,6.35; IO4 18,8.89; IO5 18,12.7; IO12 0,7.62; IO13 0,5.08; IO14 0,8.89; IO15 18,5.08; IO18 18,13.97; IO19 18,15.24; IO21 18,17.78; IO22 18,21.59; IO23 18,22.86; IO25 0,12.7; IO26 0,11.43; IO27 0,10.16; IO32 0,15.24; IO33 0,13.97; IO34 0,17.78; IO35 0,16.51; NC0 18,16.51; NC1 18,10.16; NC2 18,11.43; RXD0 18,19.05; SD0 18,2.54; SD1 18,3.81; SD2 0,3.81; SD3 0,2.54; SENSOR_VN 0,19.05; SENSOR_VP 0,20.32; TXD0 18,20.32; VDD33 0,22.86 | smd 4.5 x 4.5: GND2 7.62,16.34
SOT23-5 = smd 0.55 x 1.2: 1 -0.95,-1.3; 2 0,-1.3; 3 0.95,-1.3; 4 0.95,1.3; 5 -0.95,1.3
SOT23-5-1 = smd 0.55 x 1.2: 1 -0.95,-1.3; 2 0,-1.3; 3 0.95,-1.3; 4 0.95,1.3; 5 -0.95,1.3
SOIC8 = smd 0.6 x 2.2: 1 -1.905,-2.6; 2 -0.635,-2.6; 3 0.635,-2.6; 4 1.905,-2.6; 5 1.905,2.6; 6 0.635,2.6; 7 -0.635,2.6; 8 -1.905,2.6
KD026LQTMA008 = smd 0.3 x 1.3: CS 3.47,13.61; DB00 -6.03,13.61; DB01 -5.53,13.61; DB02 -5.03,13.61; DB03 -4.53,13.61; DB04 -4.03,13.61; DB05 -3.53,13.61; DB06 -3.03,13.61; DB07 -2.53,13.61; DB08 -2.03,13.61; DB09 -1.53,13.61; DB10 -1.03,13.61; DB11 -0.53,13.61; DB12 -0.03,13.61; DB13 0.47,13.61; DB14 0.97,13.61; DB15 1.47,13.61; DB16 1.97,13.61; DB17 2.47,13.61; DOTCLK 5.97,13.61; ENABLE 5.47,13.61; GND 10.97,13.61; GND2 10.47,13.61; GND3 -11.03,13.61; HSYNC 6.47,13.61; IM0 7.97,13.61; IM1 8.47,13.61; IM3 8.97,13.61; IOVCC 9.97,13.61; LEDA -8.53,13.61; LEDK1 -6.53,13.61; LEDK2 -7.03,13.61; LEDK3 -7.53,13.61; LEDK4 -8.03,13.61; RD 4.97,13.61; RESET 2.97,13.61; RS(SPI-SCL) 3.97,13.61; SDA 7.47,13.61; VCI 9.47,13.61; VSYNC 6.97,13.61; WR(SPI-RS) 4.47,13.61; XL -10.03,13.61; XR -9.03,13.61; YD -10.53,13.61; YU -9.53,13.61
MGB-001-ESP32-LITE = hole 2.6: 67.6,107.8; 2.15,106.8; 1.9,63.8; 67.6,63.8; 67.1,29.15; 29.1,33.6; 22.7,22.4; 2.05,23.5 | hole 3.8: 56.6,31.1 | hole 2.2: 53.6,41.1; 23.7,27.2 | hole 3.5: 46.6,22.4
53261-02 = smd 0.8 x 2: 1 0.625,-2.5; 2 -0.625,-2.5 | smd 2.1 x 3: S1 3.125,0.625; S2 -3.125,0.625

### Placement (x,y rotation side)
3V3  63,111.5 0 bottom
A  62.97,39.7 180 top
B  48.92,35.21 180 top
BACKLIGHT  58,82.5 0 bottom
C1  21,100.75 90 bottom
C2  26.75,100 0 bottom
C3  26.75,98 0 bottom
C4  18,106.75 0 bottom
C6  13,2.25 0 bottom
C7  6,7.5 0 bottom
C8  23,6.37 180 bottom
C9  6,5.09 0 bottom
C10  23,9.5 0 bottom
C13  60.5,50.3 90 bottom
C14  57,61.5 0 bottom
D4  18,104.25 0 bottom
DOWN  13.2,30.2 90 top
GND  57.5,111.5 0 bottom
GPIO0  35.3,67.5 0 bottom
J1  40.1,4.5 90 top
J4  33,111.5 180 top
J5  10,8.25 180 top
J6  5.87,89.5 90 bottom
LED2  4.5,100 90 top
LEFT  6,37.4 0 top
Q3  17.95,101 180 bottom
Q4  49.12,62.25 0 bottom
Q5  38.88,62.25 0 bottom
R1  14,96.5 270 bottom
R2  23,107.25 180 bottom
R3  13.5,105.25 270 bottom
R4  8,99 0 bottom
R5  8,101 180 bottom
R6  57,63.25 180 bottom
R9  44,63.5 0 bottom
R10  44,61.87 180 bottom
R11  35.75,16 90 bottom
R12  28,43.5 270 bottom
R13  26,43.5 270 bottom
R14  32,43.5 270 bottom
R15  30,43.5 270 bottom
R16  60,89.5 90 bottom
R17  11,75.5 270 bottom
R18  38,16 270 bottom
R19  14,12.5 90 bottom
R20  56.5,50.3 270 bottom
R21  58.5,50.3 90 bottom
R22  12,88.25 0 bottom
R24  12,91.25 0 bottom
RESET  52.7,67.5 0 bottom
RIGHT  20.4,37.4 180 top
S1  53.5,62.25 270 bottom
S2  34.5,62.25 90 bottom
S3  12,113.5 180 bottom
SELECT  30.05,16.51 0 top
SOURCE  10.75,106 0 bottom
START  41.66,16.51 0 top
SUPPLY  10.75,103 0 bottom
U1  53,81.63 0 bottom
U3  26.75,104.5 90 bottom
U4  17,96.5 180 bottom
U6  13,7 90 bottom
U$11  36.75,84.5 0 top
U$17  1,0.5 0 top
UP  13.2,44.6 270 top
VBAT  55.5,21 0 bottom
VBUS  18,89 0 bottom
VOLUME  8,65.5 0 bottom
X2  50,7 90 bottom
X3  62.75,24.5 0 bottom

### Tracks (layer width: path | path; a pad name or v marks a point on that pad's centre or on a via)
3V3  (via drill 0.3, 0.61)
  Top 0.254: 44.72,104.5 v48,104.5
  Top 0.508: 15,28.5 15,23.25 v13.25,21.5 | v13.25,55.5 11.33,53.58 UP.P$GND
  Top 0.61: J5.4 v9.6,3.9 v9.6,13.25 | v48,104.5 33,104.5 | 33,104.5 30.45,104.5 v29.5,103.55 | J4.1 33,104.5
  Bottom 0.508: C2.1 27.5,103 U3.5
  Bottom 0.61: U3.5 v29.5,103.55 | v9.6,3.9 9.6,5.09 U6.1 | U6.1 C9.1 | C6.2 12.25,5.09 U6.1 | v48,104.5 U1.VDD33 58.99,104.49 59,104.5 63,100.5 | C2.1 C3.1 27.5,82 17,72.5 R17.5 v13.25,21.5 13.25,13.25 | R6.2 63,68.5 63,92.5 | 63,92.5 63,100.5 | R11.1 35.75,15 34,13.25 R19.2 13.25,13.25 | 3V3.TP 63,100.5 | v9.6,13.25 13.25,13.25 | R16.5 63,92.5
  pour Top (no thermals): 26.3,37.4 arc-90 13.2,24.3 arc-90 0.1,37.4 arc-90 13.2,50.5 arc-90
  pour Top (no thermals): 44.58,97.45 44.58,104.75 46.87,104.75 46.87,97.45
BACKLIGHT  (via drill 0.3)
  Top 0.295: U$11.LEDA 28.22,104.72 v32,108.5 | v57,106.5 57,98.5 61,94.5 v61,88.5
  Bottom 0.295: BACKLIGHT.TP 61,82.5 v61,88.5 R16.3 | v57,106.5 55,108.5 v32,108.5
BYP
  Bottom 0.61: U6.7 C8.1
CC1
  Bottom 0.254: J6.A5 R22.2
CC2
  Bottom 0.254: J6.B5 R24.2
DOWN  (via drill 0.3)
  Top 0.406: DOWN.P$ACTIVE 11.33,30.83 13,32.5 v27,32.5
  Bottom 0.406: v27,32.5 27,37.5 28,38.5 R12.2
DTR  (via drill 0.3)
  Top 0.61: J4.6 20.3,98.8 19,97.5 19,91.5 41,69.5 v41,59.5
  Bottom 0.406: R10.1 43.25,59.75 43,59.5 v41,59.5 39,59.5 37.94,60.56 Q5.2
EN
  Bottom 0.508: U3.3 24.05,105.45 23.75,105.75 R2.2
GND  (via drill 0.3)
  other vias: 56.5,70 48.25,52 67.25,46 22.25,14.5 13,7 7.5,10 10,96.5 27,6.5
  pour Top (rank 2): 1,0.5 2,0.5 2,0 18,0 18,0.5 36.5,0.5 36.5,2.25 43.5,2.25 43.5,0.5 52.75,0.5 52.75,17.45 70.5,17.45 70.5,82 71.25,82 71.25,97 70.5,97 70.5,113.5 19,113.5 19,114.5 17.5,114.5 17.5,115 15,115 15,114.5 9,114.5 9,115 6.5,115 6.5,114.5 5,114.5 5,113.5 1,113.5 1,94.5 0,94.5 0,68 1,68
  pour Bottom (rank 6): 1,0.5 2,0.5 2,0 18,0 18,0.5 36.5,0.5 36.5,2.25 43.5,2.25 43.5,0.5 52.75,0.5 52.75,17.45 70.5,17.45 70.5,82 71.25,82 71.25,97 70.5,97 70.5,113.5 19,113.5 19,114.5 17.5,114.5 17.5,115 15,115 15,114.5 9,114.5 9,115 6.5,115 6.5,114.5 5,114.5 5,113.5 1,113.5 1,94.5 0,94.5 0,68 1,68
GPIO0
  Bottom 0.406: 35.3,62.5 S2.3 GPIO0.TP 44,76.2 44,81 39,86 39,88.5 38.25,89.25 U1.IO0 | 35.3,62.5 S2.4 | Q5.3 38.03,62.5 35.3,62.5
GPIO5  (via drill 0.3)
  Top 0.295: U$11.CS 40.22,96.72 v38,94.5
  Bottom 0.295: v38,94.5 37.83,94.33 U1.IO5
GPIO18  (via drill 0.3, 0.61)
  Top 0.254: 40.72,95.72 v40.72,95.6
  Top 0.295: U$11.RS(SPI-SCL) 40.72,95.72
  Top 0.406: J5.5 8.5,16.5 10,18 v17,18 | v42,54.5 51,63.5 v51,75.5
  Bottom 0.406: U1.IO18 v40.72,95.6 40.72,86 v51,75.5 | v17,18 29,18 42,31 v42,54.5
GPIO19  (via drill 0.3, 0.61)
  Top 0.406: J5.7 6.3,17.8 7.5,19 v16,19 | v41,55.5 50,64.5 v50,78.5
  Bottom 0.406: v16,19 29,19 41,31 v41,55.5 | U1.IO19 40.63,96.87 42,95.5 42,86.5 v50,78.5
GPIO21  (via drill 0.3)
  Top 0.295: U$11.WR(SPI-RS) 41.22,101.28 41,101.5 39,101.5 v38,100.5
  Bottom 0.295: U1.IO21 36.91,99.41 v38,100.5
GPIO22  (via drill 0.3, 0.61)
  Top 0.406: v19,16 16.5,16 15,14.5 15,6.5 11.8,3.3 J5.2 | v44,52.5 53,61.5 53,98.5 v49,102.5
  Bottom 0.406: v19,16 29,16 44,31 v44,52.5 | U1.IO22 41.28,103.22 42,102.5 v49,102.5
GPIO23  (via drill 0.3, 0.61)
  Top 0.295: v43,103.5 44.22,102.28 U$11.SDA 44.22,95.28 52,87.5 52,62.5
  Top 0.406: J5.3 10.7,14.7 13,17 v18,17 | v43,53.5 52,62.5
  Bottom 0.295: v43,103.5 42.01,104.49 U1.IO23
  Bottom 0.406: v18,17 29,17 43,31 v43,53.5
GPIO26  (via drill 0.3)
  Top 0.406: v6.5,20 v14.5,20 | v40,56.5 49,65.5 v49,88.5
  Bottom 0.406: C7.2 5.25,18.75 v6.5,20 | v14.5,20 29,20 40,31 v40,56.5 | v49,88.5 49,91.5 50.56,93.06 U1.IO26
GPIO27  (via drill 0.3)  (6 unrouted)
  Top 0.406: SELECT.P$ACTIVE 33.05,31.55 47,45.5 47,53.5 55,61.5 v55,76.5
  Bottom 0.406: v55,76.5 50,81.5 50,90.5 51.29,91.79 U1.IO27
GPIO32  (via drill 0.3)
  Top 0.406: v56.5,96.87 56.63,96.87 60,93.5 60,49.5 62.27,47.23 | A.P$ACTIVE1 62.27,47.23 | A.P$ACTIVE 65.32,44.18 62.27,47.23
  Bottom 0.406: v56.5,96.87 U1.IO32
GPIO33  (via drill 0.3)
  Top 0.406: v56.5,95.5 59,93 59,92.5 59,61.5 51.27,53.77 51.27,43.5 | B.P$ACTIVE 51.27,43.5 | B.P$ACTIVE1 48.22,40.45 51.27,43.5
  Bottom 0.406: v56.5,95.5 53.1,95.5 U1.IO33
GPIO34  (via drill 0.3)
  Top 0.406: v47,84.5 v41.5,79 | v31,40.5 25,40.5 23,42.5 18,42.5 15,39.5 5.23,39.5 LEFT.P$ACTIVE
  Bottom 0.406: 31,44.25 R15.1 30,67.5 v41.5,79 | 31,44.25 R14.1 | v47,84.5 47,92.5 50,95.5 50,98.5 50.91,99.41 U1.IO34 | 31,44.25 v31,40.5
GPIO35  (via drill 0.3)
  Top 0.406: v48,87.5 v40.5,80 | UP.P$ACTIVE 15.97,46.5 v25,46.5
  Bottom 0.406: R13.1 27,44.25 | 27,44.25 R12.1 28,67.5 v40.5,80 | v48,87.5 48,92 51,95 51,97.5 51.64,98.14 U1.IO35 | v25,46.5 27,46.5 27,44.25
GPIO36  (via drill 0.3)
  Top 0.61: v60,101.5 v64,97.5
  Bottom 0.406: R20.1 R21.2 C13.2
  Bottom 0.61: U1.SENSOR_VP 59.55,101.95 v60,101.5 | v64,97.5 64,54.55 C13.2
GPIO39  (via drill 0.3)  (6 unrouted)
  Top 0.406: START.P$ACTIVE2 38.65,15.5 37,15.5 36,16.5 v36,20 36,32.5 49.5,46 49.5,54 58,62.5 58,92.5 55,95.5 v55,99.5
  Bottom 0.406: R11.2 35.75,19.75 v36,20 | v55,99.5 55,100 54.32,100.68 U1.SENSOR_VN
HEADPHONES
  Bottom 0.61: U6.3 11.63,7.63 12.5,8.5 12.5,11 13.25,11.75 R19.1 36,11.75 36.75,11.75 | J1.RSH 37.6,10.9 36.75,11.75 | 36.75,11.75 41.75,11.75 42.6,10.9 J1.TSH
POWER_LED
  Bottom 0.508: LED2.3 5.71,102.54 R5.1
PROG
  Bottom 0.508: R1.2 16.05,95.75 U4.5
RESET  (via drill 0.3)
  Top 0.295: v40,100.5 39.72,100.22 U$11.RESET 39.72,97.22 37,94.5 37,77.5 v44,70.5
  Bottom 0.295: v40,100.5 41,101.5 50,101.5 51.72,103.22 U1.EN | v44,70.5 49.12,65.39 Q4.3
  Bottom 0.406: 52.7,62.5 S1.4 RESET.TP | S1.3 52.7,62.5 | Q4.3 49.97,62.5 52.7,62.5 | C14.2 56.25,62.5 | 56.25,62.5 R6.1 | 52.7,62.5 56.25,62.5
RIGHT  (via drill 0.3)
  Top 0.406: RIGHT.P$ACTIVE 26.03,35.53 28,37.5 v32,37.5
  Bottom 0.406: v32,37.5 R14.2
RST-RES
  Bottom 0.406: R10.2 44.75,59.75 45,59.5 49,59.5 50.06,60.56 Q4.1
RTS  (via drill 0.3)
  Top 0.61: J4.5 22.84,99.34 20,96.5 20,92.5 v44,68.5
  Bottom 0.406: R9.1 45.91,63.5 Q4.2
  Bottom 0.61: R9.1 44.75,67.75 v44,68.5
RTS-RES
  Bottom 0.406: Q5.1 42.09,63.5 R9.2
RXD0
  Bottom 0.61: U1.RXD0 33.32,100.68 32,102 32,104.5 27.92,108.58 J4.3
SOURCE
  Bottom 0.508: C4.1 18.75,107.75 18,108.5 13,108.5 12.75,108.5 | SOURCE.TP 10.75,107.25 12,108.5 12.75,108.5 | S3.P 12.75,108.5
  Bottom 0.61: C4.1 19.85,105.65 D4.C 19.85,102.95 Q3.2
STAT
  Bottom 0.508: R4.1 15.5,99 16.05,98.45 U4.1
STAT_LED
  Bottom 0.508: LED2.1 5.71,97.46 R4.2
SUPPLY  (via drill 0.3)
  Top 0.508: v11,109.5 v14.25,109.5
  Bottom 0.508: U3.1 23.95,103.55 22.25,105.25 R2.1 20,109.5 v14.25,109.5 S3.S | R5.2 8.75,102.5 8.75,103 | 8.75,103 8.75,107.25 v11,109.5 | SUPPLY.TP 8.75,103
TXD0  (via drill 0.3)
  Top 0.61: v29.5,108.5 26,108.5 25.38,109.12 J4.4
  Bottom 0.61: U1.TXD0 33.55,101.95 33,102.5 33,105 v29.5,108.5
VBAT  (via drill 0.3)
  Top 0.61: v45.5,49.5 38,49.5 16,71.5 v16,100
  Bottom 0.508: U4.3 Q3.3 C1.1
  Bottom 0.61: v45.5,49.5 56.45,49.5 R20.2 56.5,47.55 62.12,41.92 62.12,22.5 X3.1 62.12,21 VBAT.TP | Q3.3 v16,100
VBUS  (via drill 0.3)
  Top 0.508: v9,86.5 v9,92.5 13.5,97 v13.5,100.5
  Bottom 0.508: R3.2 v13.5,100.5 | VBUS.TP 17.95,89.05 17.95,93.5 | 17.95,93.5 U4.4 | J6.B4/A9 8.4,91.9 v9,92.5 10,93.5 17.95,93.5 | J6.A4/B9 8.4,87.1 v9,86.5
  Bottom 0.61: R3.2 15.9,104.5 D4.A 16.15,102.85 Q3.1
VIN
  Bottom 0.61: U6.2 7.88,6.37 C7.1
VIN1
  Top 0.61: J1.RING 35,11 36,12 44.5,12 45.2,11.3 J1.TIP
  Bottom 0.508: R18.2 43.25,15.25 45.2,13.3 J1.TIP
  Bottom 0.61: C10.- J1.RING
VOLUME
  Bottom 0.61: R17.3 8,76.5 VOLUME.TP 8,12.5 10.4,10.1 U6.4
VOUT1
  Bottom 0.508: X2.1 22.12,7.62 21.52,8.22 C10.+
  Bottom 0.61: U6.5 16.2,9.5 C10.+
VOUT2
  Bottom 0.508: 31.59,5.09 32.88,6.38 X2.2
  Bottom 0.61: U6.8 31.59,5.09
(copper drawn outside any net)
  shapes: Bottom area x4

### Text on the board
tNames: DTR | RTS | RXD | TXD | GND | VCC | A | B | SELECT | START
bNames: DTR | RTS | RXD | TXD | GND | VCC | GND | 3V3 | SOURCE | SUPPLY | VBUS | BACKLIGHT | GPIO0 | RESET | VOLUME | ! | RED WIRE | BLACK WIRE | ⇪ | ⇪ | VBAT
Reference: Credits: / Name: Eugene Yevhen Andruszczenko / GitHub: 32teeth